# Altium project Flomio BLE-NFC.PrjPCB
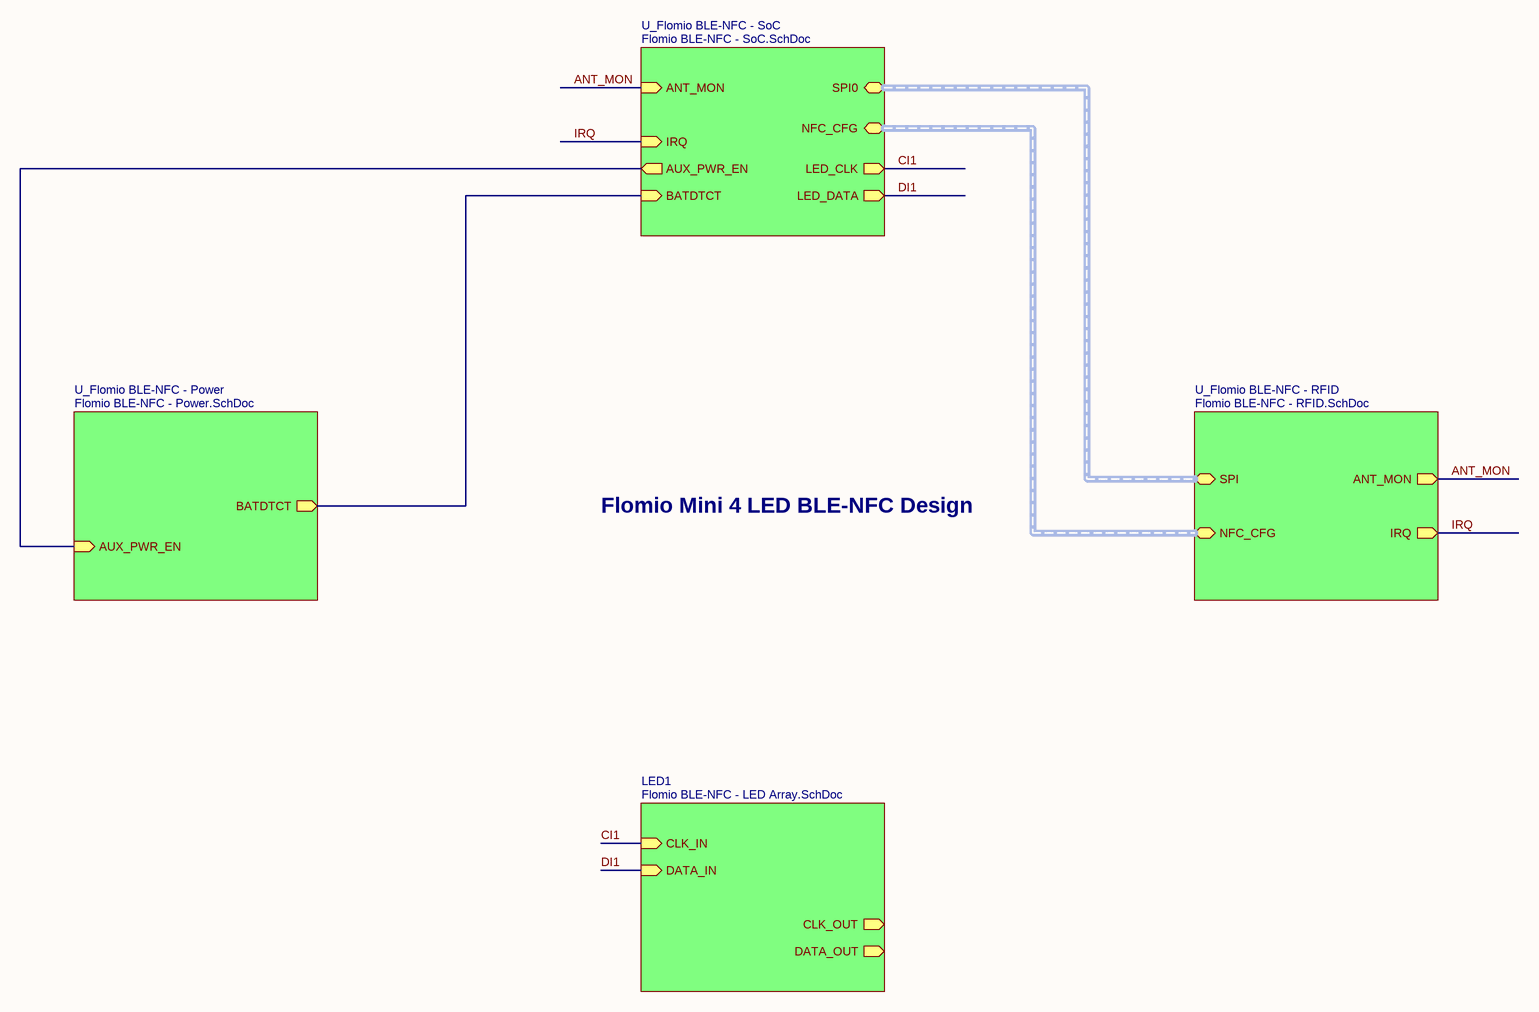
[diagram p0: Flomio BLE-NFC - Overview.SchDoc]
5 sheets, 143 parts. Net scope: hierarchical (ports join the sheet entries above them; power ports are global).
Board file: Flomio BLE-NFC.PcbDoc
Sheets:
  Flomio BLE-NFC - Overview.SchDoc
    LED1 = Flomio BLE-NFC - LED Array.SchDoc
    U_Flomio BLE-NFC - SoC = Flomio BLE-NFC - SoC.SchDoc
    U_Flomio BLE-NFC - RFID = Flomio BLE-NFC - RFID.SchDoc
    U_Flomio BLE-NFC - Power = Flomio BLE-NFC - Power.SchDoc

## Sheet Flomio BLE-NFC - Overview.SchDoc: Flomio BLE-NFC::Overview
size Tabloid; Author: Alex J. Tucker; CompanyName: Anidea Engineering, Inc.; DrawnBy: Alex J. Tucker; Engineer: Alex J. Tucker; Organization: Anidea Engineering, Inc.; Address1: 8020 Belvedere Rd.; Address2: Ste #1; Address3: West Palm Beach, FL; Address4: 33411    USA; DocumentNumber: 1; Revision: 3; SheetNumber: 1; SheetTotal: 5

### Sub-sheets
LED1 = Flomio BLE-NFC - LED Array.SchDoc: CLK_OUT (out), CLK_IN (in), DATA_IN (in), DATA_OUT (out)
U_Flomio BLE-NFC - Power = Flomio BLE-NFC - Power.SchDoc: BATDTCT (out), AUX_PWR_EN (in)
U_Flomio BLE-NFC - RFID = Flomio BLE-NFC - RFID.SchDoc: ANT_MON (out), SPI (harness SPI), NFC_CFG (harness NFC), IRQ (out)
U_Flomio BLE-NFC - SoC = Flomio BLE-NFC - SoC.SchDoc: ANT_MON (in), BATDTCT (in), SPI0 (harness SPI), NFC_CFG (harness NFC), LED_CLK (out), LED_DATA (out), IRQ (in), AUX_PWR_EN (out)

### Nets
ANT_MON: sheet U_Flomio BLE-NFC - SoC/ANT_MON, sheet U_Flomio BLE-NFC - RFID/ANT_MON
BATDTCT: sheet U_Flomio BLE-NFC - SoC/BATDTCT, sheet U_Flomio BLE-NFC - Power/BATDTCT
CI1: sheet LED1/CLK_IN, sheet U_Flomio BLE-NFC - SoC/LED_CLK
DI1: sheet LED1/DATA_IN, sheet U_Flomio BLE-NFC - SoC/LED_DATA  [project net DATA_IN]
IRQ: sheet U_Flomio BLE-NFC - SoC/IRQ, sheet U_Flomio BLE-NFC - RFID/IRQ
NetQ2_1: sheet U_Flomio BLE-NFC - SoC/AUX_PWR_EN, sheet U_Flomio BLE-NFC - Power/AUX_PWR_EN

### Buses and harness runs
harness sheet U_Flomio BLE-NFC - RFID/NFC_CFG = sheet U_Flomio BLE-NFC - SoC/NFC_CFG
harness sheet U_Flomio BLE-NFC - RFID/SPI = sheet U_Flomio BLE-NFC - SoC/SPI0

### Notes on the sheet
- Flomio Mini 4 LED BLE-NFC Design
- Confidential Document
  Unauthorized Use or Release
  Prohibited
- Checked By:
- Designed By:
- Title
- Size:
- Date:
- Tabloid
- Number:
- Time:
- Revision:
- Sheet
- of
- Approved By:
- File:

## Sheet Flomio BLE-NFC - LED Array.SchDoc: Flomio BLE-NFC::LED Array
size Tabloid; Author: Alex J. Tucker; CompanyName: Anidea Engineering, Inc.; DrawnBy: Alex J. Tucker; Engineer: Alex J. Tucker; Organization: Anidea Engineering, Inc.; Address1: 8020 Belvedere Rd.; Address2: Ste #1; Address3: West Palm Beach, FL; Address4: 33411    USA; DocumentNumber: 4; Revision: 3; SheetNumber: 4; SheetTotal: 5
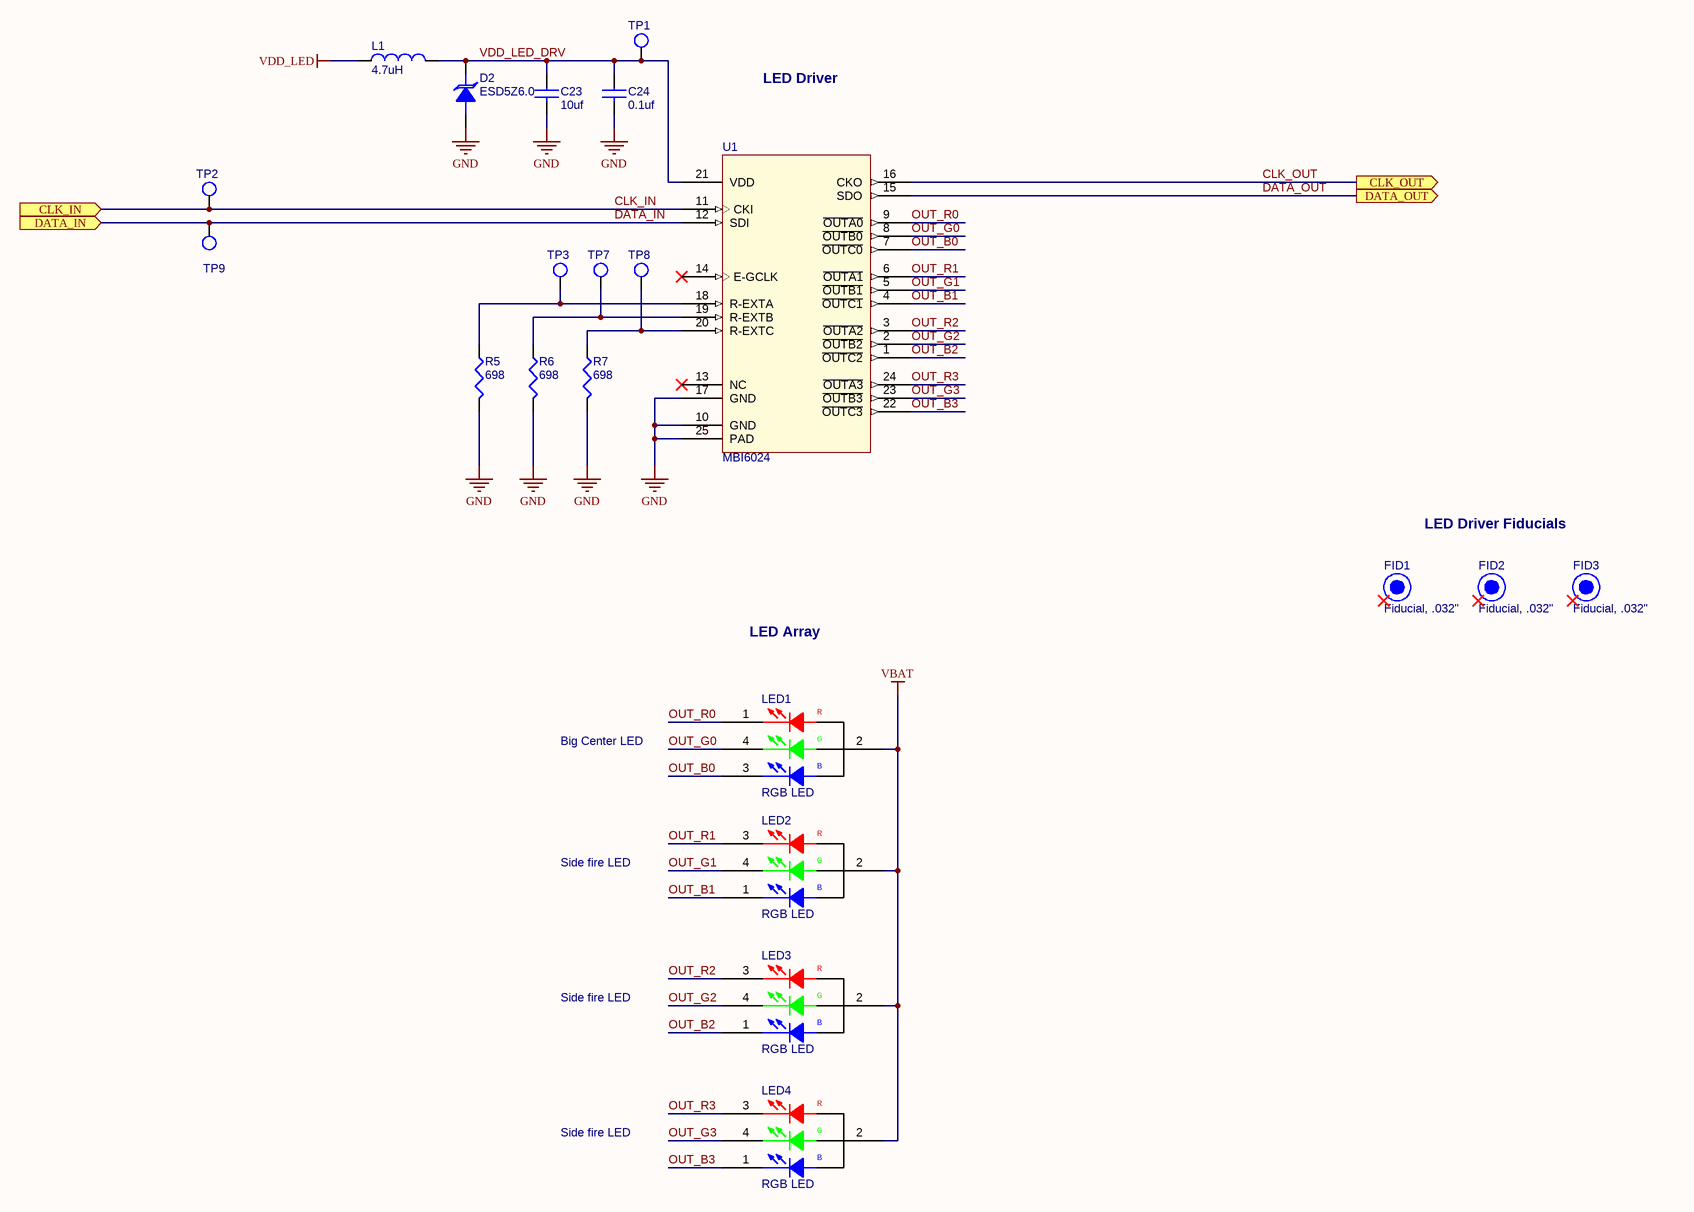
[diagram p1: Flomio BLE-NFC - LED Array.SchDoc]

### Parts
C23  10uf  [SM/C_0603]
C24  0.1uf  [SM/C_0402]
D2  ESD5Z6.0  [SOD-523]
FID1  Fiducial, .032"  [FID32]  (no BOM)
FID2  Fiducial, .032"  [FID32]  (no BOM)
FID3  Fiducial, .032"  [FID32]  (no BOM)
L1  4.7uH  [SM/I_0805]
LED1  RGB LED  [LED/PLCC4;LED/PLCC4/NOSLK]
LED2  RGB LED  [LED/AVAGO/HSMF-C115]
LED3  RGB LED  [LED/AVAGO/HSMF-C115]
LED4  RGB LED  [LED/AVAGO/HSMF-C115]
R5  698  [SM/R_0402]
R6  698  [SM/R_0402]
R7  698  [SM/R_0402]
TP1  TP  [VIA18]  (value not drawn)  (no BOM)
TP2  TP  [VIA18]  (value not drawn)  (no BOM)
TP3  TP  [VIA18]  (value not drawn)  (no BOM)
TP7  TP  [VIA18]  (value not drawn)  (no BOM)
TP8  TP  [VIA18]  (value not drawn)  (no BOM)
TP9  TP  [VIA18]  (value not drawn)  (no BOM)
U1  MBI6024  [QFN50P400X400X80-24N]

### Ports
CLK_IN (in), CLK_OUT (out), DATA_IN (in), DATA_OUT (out)

### Nets
GND: C23.2 C24.2 D2.1(ANODE) R5.2 R6.2 R7.2 U1.10(GND) U1.17(GND) U1.25(PAD)
VBAT: LED1.2(ANODDE) LED2.2(ANODDE) LED3.2(ANODDE) LED4.2(ANODDE)
VDD_LED: L1.1
CLK_IN: TP2.1(TP) U1.11(CKI) ; port CLK_IN  [project net CI1]
CLK_OUT: U1.16(CKO) ; port CLK_OUT
DATA_IN: TP9.1(TP) U1.12(SDI) ; port DATA_IN
DATA_OUT: U1.15(SDO) ; port DATA_OUT
OUT_B0: LED1.3(BLUEK) U1.7(~{OUTC0})
OUT_B1: LED2.1(BLUEK) U1.4(~{OUTC1})
OUT_B2: LED3.1(BLUEK) U1.1(~{OUTC2})
OUT_B3: LED4.1(BLUEK) U1.22(~{OUTC3})
OUT_G0: LED1.4(GREENK) U1.8(~{OUTB0})
OUT_G1: LED2.4(GREENK) U1.5(~{OUTB1})
OUT_G2: LED3.4(GREENK) U1.2(~{OUTB2})
OUT_G3: LED4.4(GREENK) U1.23(~{OUTB3})
OUT_R0: LED1.1(REDK) U1.9(~{OUTA0})
OUT_R1: LED2.3(REDK) U1.6(~{OUTA1})
OUT_R2: LED3.3(REDK) U1.3(~{OUTA2})
OUT_R3: LED4.3(REDK) U1.24(~{OUTA3})
VDD_LED_DRV: C23.1 C24.1 D2.2(CATHODE) L1.2 TP1.1(TP) U1.21(VDD)
NetR5_1: R5.1 TP3.1(TP) U1.18(R-EXTA)
NetR6_1: R6.1 TP7.1(TP) U1.19(R-EXTB)
NetR7_1: R7.1 TP8.1(TP) U1.20(R-EXTC)

Not connected (* = marked no-connect by the designer): FID1 1*; FID2 1*; FID3 1*; U1 13(NC)* 14(E-GCLK)*

### Notes on the sheet
- LED Driver
- LED Driver Fiducials
- LED Array
- Big Center LED
- Side fire LED
- Confidential Document
  Unauthorized Use or Release
  Prohibited
- Checked By:
- Designed By:
- Title
- Size:
- Date:
- Tabloid
- Number:
- Time:
- Revision:
- Sheet
- of
- Approved By:
- File:
- (in symbol CLVBA-FKA) R; G; B
- (in symbol HSMF-C115) R; G; B

### Library data of the parts
C23 = GRM188R60J106ME47: Cap, 0603, 10uf, 6.3V, 20%,; Mfg Part Number: GRM188R60J106ME47D; Mfg: Murata; Part Number: GRM188R60J106ME47; Tolerance: 20%; Voltage: 6.3V; ComponentLink1Description: Local; ComponentLink1URL: \\brak\public\pdf\Murata Cap PN.pdf; ComponentLink2Description: Web; Supplier Part Number 1: 490-3896-1-ND; Supplier 1: Digi-Key; RoHS: True
C24 = GRM155R71C104KA88: Cap, 0402, 0.1uf, 16V, 10%; Mfg Part Number: GRM155R71C104KA88D; Mfg: Murata; Part Number: GRM155R71C104KA88; Tolerance: 10%; Voltage: 16V; ComponentLink1Description: Local; ComponentLink1URL: \\brak\public\pdf\Murata Cap PN.pdf; ComponentLink2Description: Web; Supplier Part Number 1: 490-3261-1-ND; Supplier 1: Digi-Key; RoHS: True
D2 = ESD5Z6.0T1G: TVS, ESD, 6.0V, 30KV Pk, Unidirectional, SMT; Mfg: Onsemi; Rating: 240W; Part Number: ESD5Z6.0T1G; Voltage: 6.0V; Mfg Part Number: ESD5Z6.0T1G; ComponentLink1Description: Local; ComponentLink1URL: \\newbrak\public\pdf\Onsemi ESD5Z TVS-ESD.pdf; ComponentLink2Description: Web; Supplier Part Number 1: ESD5Z6.0T1GOSTR-ND; Supplier 1: Digi-Key; RoHS: True
FID1-FID3 = FID32: Fiducual, .032" Pad; Obsolete: False; Part Number: FID32; ComponentLink1Description: Local; ComponentLink1URL: \\brak\public\pdf\; ComponentLink2Description: Web; RoHS: False; Part Type: Misc\Fiducual
L1 = LQG21C4R7N00T1: Inductor, 4.7uH, 0805; Mfg: Murata; Rating: 30mA; Part Number: LQG21C4R7N00T1; Mfg Part Number: LQG21C4R7N00T1; ComponentLink1Description: Local; ComponentLink1URL: \\brak\public\pdf\\Murata SMT Inductors Chip Coils.pdf; ComponentLink2Description: Web; RoHS: True; ComponentLink2URL: http://search.murata.co.jp/Ceramy/image/img/PDF/ENG/L0075S0097LQM21D.pdf; Supplier Part Number 1: 490-1120-1-ND; Supplier 1: Digi-Key
LED1 = CLVBA-FKA: Diode, Led, RGB, PLCC4; Mfg Part Number: CLVBA-FKA-CAEDH8BBB7a36; Mfg: Cree; Part Number: CLVBA-FKA; ComponentLink1Description: Local; ComponentLink1URL: \\newbrak\public\pdf\Cree CLVBA-FKA RGB Led.pdf; ComponentLink2Description: Web; ComponentLink2URL: http://www.cree.com/products/pdf/ledlamps/CLVBA-FKA.pdf; Supplier Part Number 1: CLVBA-FKA-CAEDH8BBB7A363TR-ND; Supplier 1: Digi-key; RoHS: True
LED2-LED4 = HSMF-C115: Diode, Led, RGB, Side looking; Mfg: Avago; Part Number: HSMF-C115; Mfg Part Number: HSMF-C115; ComponentLink1Description: Local; ComponentLink1URL: \\brak\public\pdf\Avago AV02-0611EN LED.pdf; ComponentLink2Description: Web; ComponentLink2URL: http://www.avagotech.com/docs/AV02-0611EN; Supplier Part Number 1: HSMF-C115-ND; Supplier 1: Digi-key; RoHS: True
R5-R7 = CRCW0402698RFK: Resistor, 0402, 698 Ohm 1%; Mfg Part Number: CRCW0402698RFKED; Rating: 1/10W; Mfg: Vishay; Part Number: CRCW0402698RFK; Tolerance: 1%; ComponentLink1Description: Local; ComponentLink1URL: \\brak\public\pdf\Vishay CRCW Resistors.pdf; ComponentLink2Description: Web; Supplier Part Number 1: 541-698LCT-ND; Supplier 1: Digi-Key; RoHS: True
TP1-TP3 TP7-TP9 = TP18: Testpoint, 18mil Hole, No part, just via; Part Number: TP18; ComponentLink1Description: Local; ComponentLink2Description: Web; RoHS: False
U1 = MBI6024GFN: IC, Driver, 3x4 Led Driver, QFN24; Voltage: 5V; Mfg: Macroblock; Part Number: MBI6024GFN; Mfg Part Number: MBI6024GFN; ComponentLink1Description: Local; ComponentLink1URL: \\newbrak\public\pdf\Macroblock MBI6024 Preliminary Datasheet V2.00-EN.pdf; ComponentLink2Description: Web; ComponentLink2URL: http://www.mblock.com.tw/downfile.php?Code=ad13a2a07ca4b7642959dc0c4c740ab6; RoHS: True

## Sheet Flomio BLE-NFC - SoC.SchDoc: Flomio BLE-NFC::Soc
size Tabloid; Author: Alex J. Tucker; CompanyName: Anidea Engineering, Inc.; DrawnBy: Alex J. Tucker; Engineer: Alex J. Tucker; Organization: Anidea Engineering, Inc.; Address1: 8020 Belvedere Rd.; Address2: Ste #1; Address3: West Palm Beach, FL; Address4: 33411    USA; DocumentNumber: 2; Revision: 3; SheetNumber: 2; SheetTotal: 5
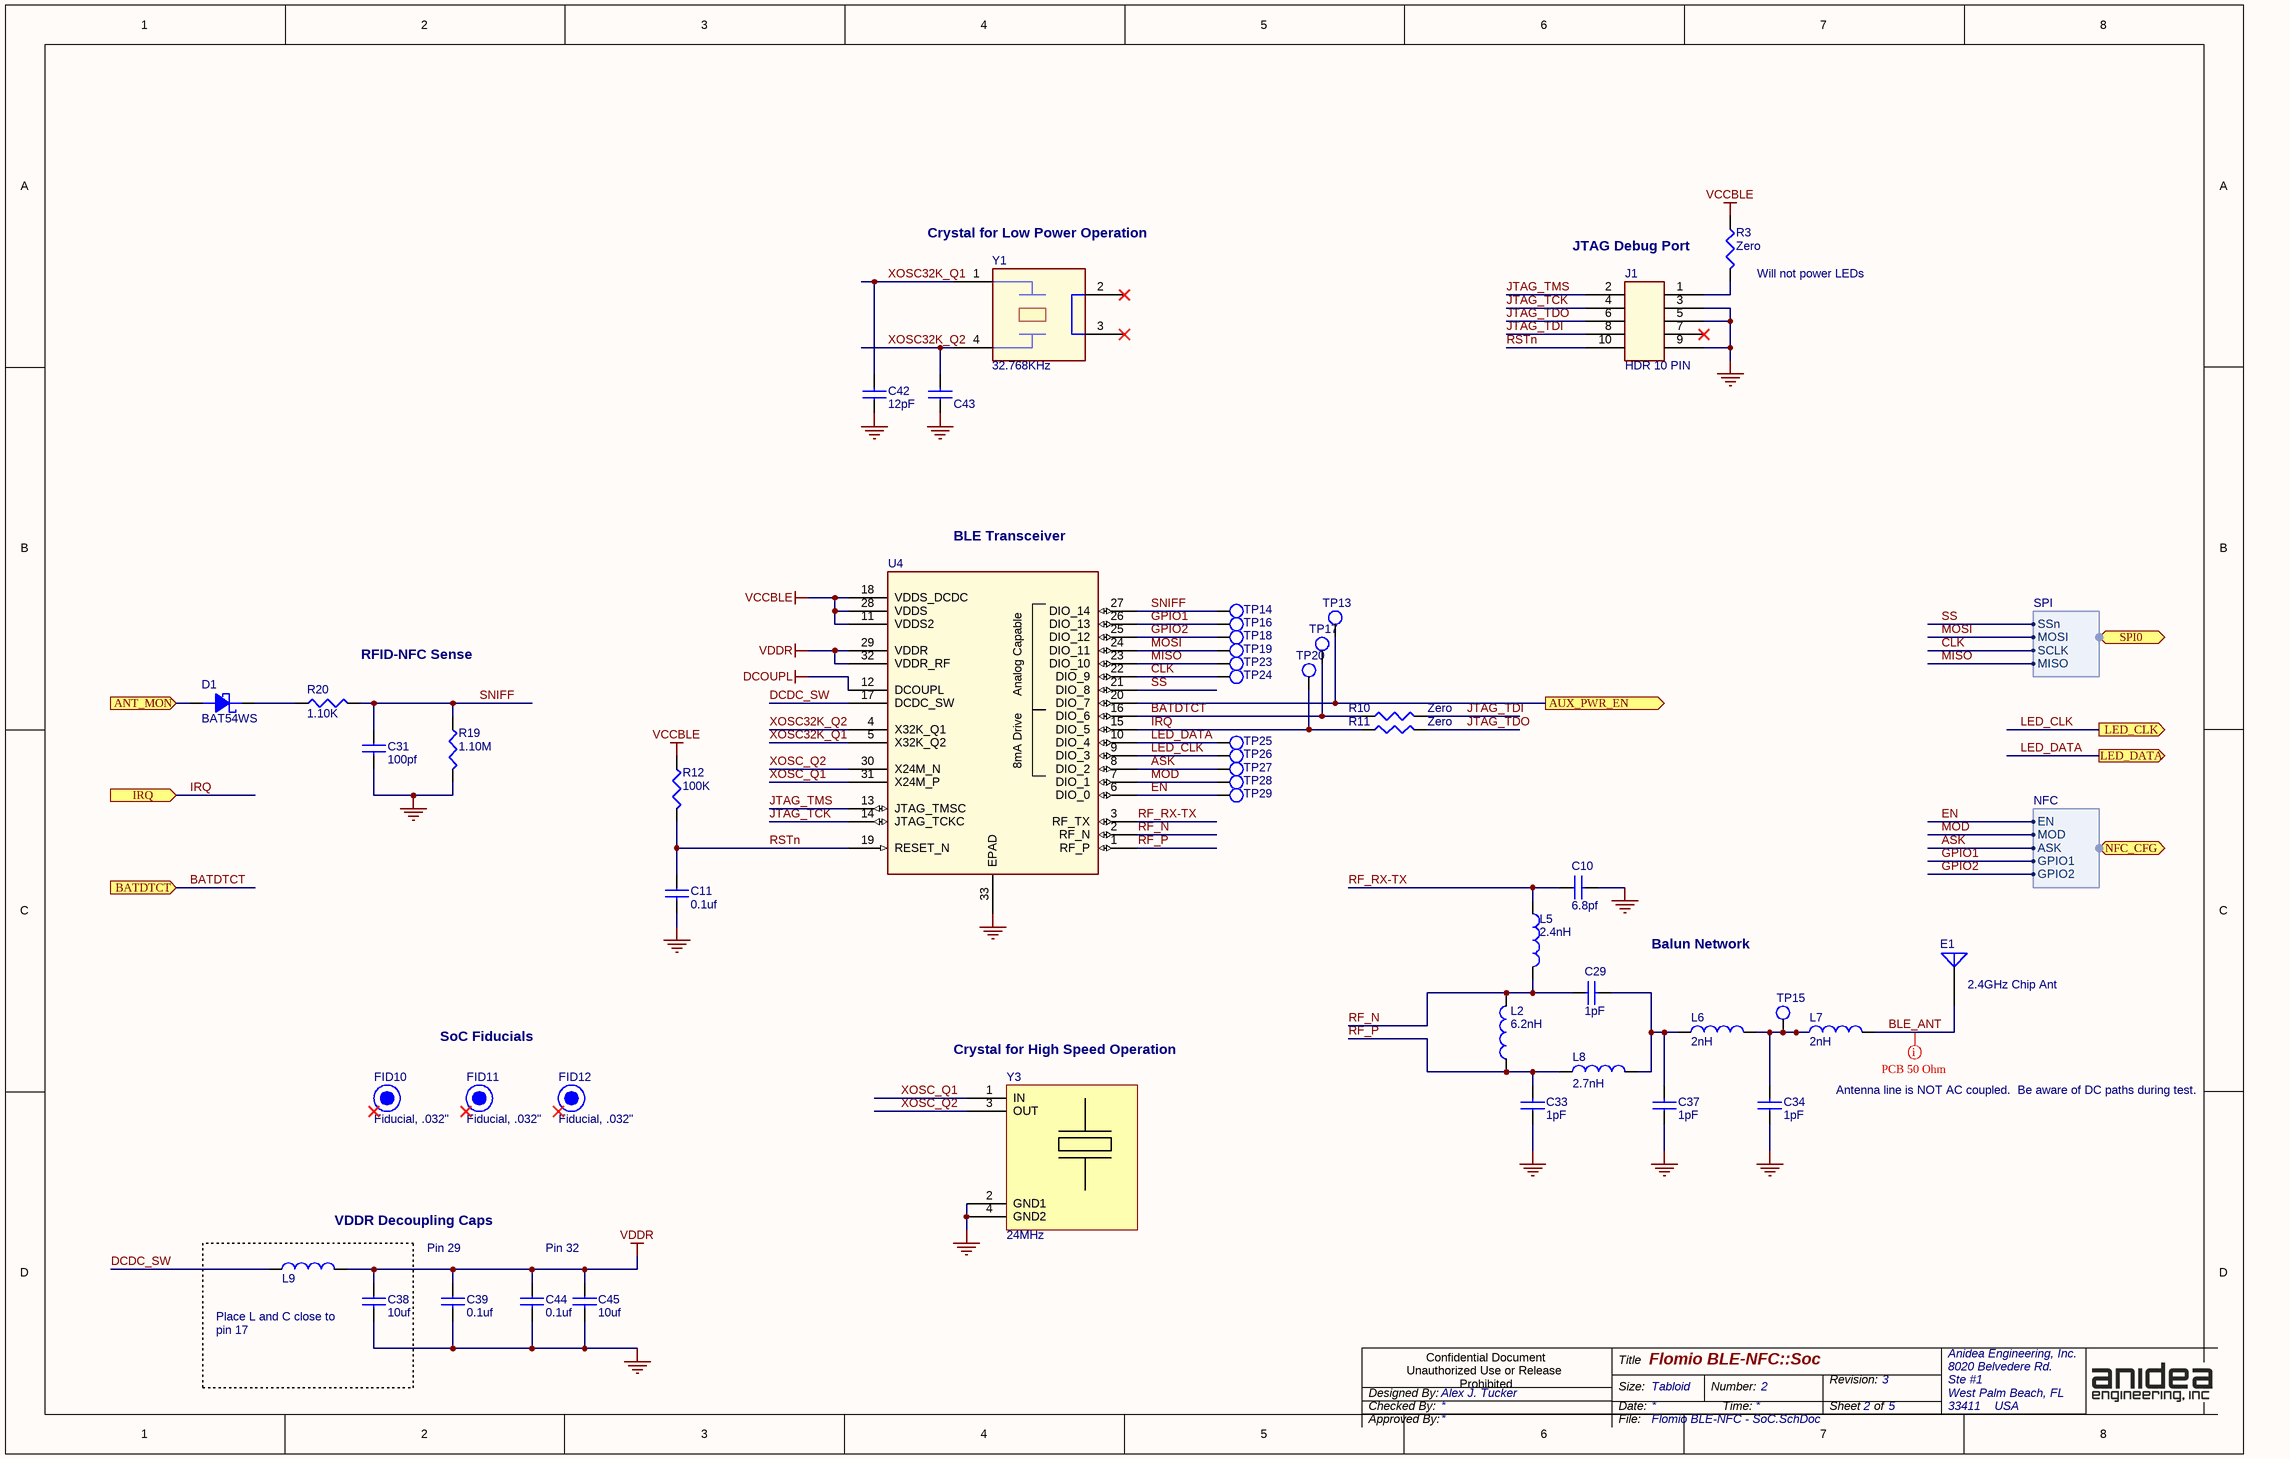
[diagram p2: Flomio BLE-NFC - SoC.SchDoc]

### Parts
(Parts that share a designator on the sheet are numbered #1, #2 ... from top to bottom, then left to right.)
C10  6.8pf  [SM/C_0603]
C11  0.1uf  [SM/C_0603]
C29#1  1pF  [SM/C_0402]
C31  100pf  [SM/C_0603]
C33#1  1pF  [SM/C_0402]
C34#1  1pF  [SM/C_0402]
C37  1pF  [SM/C_0402]
C38  10uf  [SM/C_0603]
C39  0.1uf  [SM/C_0603]
C42#1  12pF  [SM/C_0402]
C43  12pF  [SM/C_0402]  (value not drawn)
C44  0.1uf  [SM/C_0603]
C45  10uf  [SM/C_0603]
D1  BAT54WS  [SOD-323]
E1  2.4GHz Chip Ant  [SM_ANT_Johanson-2450AT43A100E]
FID10  Fiducial, .032"  [FID32]  (no BOM)
FID11  Fiducial, .032"  [FID32]  (no BOM)
FID12  Fiducial, .032"  [FID32]  (no BOM)
J1  HDR 10 PIN  [HDR/SM/2X5/1.27MM]
L2  6.2nH  [SM/I_0402]
L5#1  2.4nH  [SM/I_0402]
L6  2nH  [SM/I_0402]
L7  2nH  [SM/I_0402]
L8  2.7nH  [SM/I_0402]
L9  10uH  [SM/I_1210]  (value not drawn)
R3  Zero  [SM/R_0402]
R10  Zero  [SM/R_0402]
R11  Zero  [SM/R_0402]
R12  100K  [SM/R_0402]
R19  1.10M  [SM/R_0603]
R20  1.10K  [SM/R_0603]
TP13  TP  [VIA18]  (value not drawn)  (no BOM)
TP14  TP  [VIA18]  (value not drawn)  (no BOM)
TP15  TP  [VIA18]  (value not drawn)  (no BOM)
TP16  TP  [VIA18]  (value not drawn)  (no BOM)
TP17  TP  [VIA18]  (value not drawn)  (no BOM)
TP18  TP  [VIA18]  (value not drawn)  (no BOM)
TP19  TP  [VIA18]  (value not drawn)  (no BOM)
TP20  TP  [VIA18]  (value not drawn)  (no BOM)
TP23  TP  [VIA18]  (value not drawn)  (no BOM)
TP24  TP  [VIA18]  (value not drawn)  (no BOM)
TP25  TP  [VIA18]  (value not drawn)  (no BOM)
TP26  TP  [VIA18]  (value not drawn)  (no BOM)
TP27  TP  [VIA18]  (value not drawn)  (no BOM)
TP28  TP  [VIA18]  (value not drawn)  (no BOM)
TP29  TP  [VIA18]  (value not drawn)  (no BOM)
U4  CC2640_RHB_32  (value not drawn)
Y1  32.768KHz  [CRYSTAL/ABS25]
Y3#1  24MHz  [CRYSTAL/3.2x2.5mm]

### Blocks framed on the sheet
VDDR Decoupling Caps: C38 L9

### Ports
ANT_MON (in), AUX_PWR_EN (out), BATDTCT (in), IRQ (in), LED_CLK (out), LED_DATA (out), NFC_CFG (harness NFC), SPI0 (harness SPI)

### Harnesses
SPI: SSn, MOSI, SCLK, MISO
NFC: EN, MOD, ASK, GPIO1, GPIO2

### Nets
DCOUPL: U4.12(DCOUPL)
GND: C10.2 C11.2 C31.2 C33#1.1 C34#1.1 C37.1 C38.2 C39.2 C42#1.1 C43.1 C44.2 C45.2 J1.3 J1.5 J1.9 R19.2 U4.33(EPAD) Y3#1.2(GND1) Y3#1.4(GND2)
VCCBLE: R3.1 R12.1 U4.11(VDDS2) U4.18(VDDS_DCDC) U4.28(VDDS)
VDDR: C38.1 C39.1 C44.1 C45.1 L9.2 U4.29(VDDR) U4.32(VDDR_RF)
ANT_MON: D1.1(ANODE) ; port ANT_MON
ASK: TP27.1(TP) U4.8(DIO_2) ; port NFC_CFG.ASK
BATDTCT: R10.1 TP17.1(TP) U4.16(DIO_6) ; port BATDTCT
BLE_ANT: E1.1 L7.2
CLK: TP24.1(TP) U4.22(DIO_9) ; port SPI0.SCLK
DCDC_SW: L9.1 U4.17(DCDC_SW)
EN: TP29.1(TP) U4.6(DIO_0) ; port NFC_CFG.EN
GPIO1: TP16.1(TP) U4.26(DIO_13) ; port NFC_CFG.GPIO1
GPIO2: TP18.1(TP) U4.25(DIO_12) ; port NFC_CFG.GPIO2
IRQ: R11.1 TP20.1(TP) U4.15(DIO_5) ; port IRQ
JTAG_TCK: J1.4 U4.14(JTAG_TCKC)
JTAG_TDI: J1.8 R10.2
JTAG_TDO: J1.6 R11.2
JTAG_TMS: J1.2 U4.13(JTAG_TMSC)
LED_CLK: TP26.1(TP) U4.9(DIO_3) ; port LED_CLK  [project net CI1]
LED_DATA: TP25.1(TP) U4.10(DIO_4) ; port LED_DATA  [project net DATA_IN]
MISO: TP23.1(TP) U4.23(DIO_10) ; port SPI0.MISO
MOD: TP28.1(TP) U4.7(DIO_1) ; port NFC_CFG.MOD
MOSI: TP19.1(TP) U4.24(DIO_11) ; port SPI0.MOSI
RF_N: C29#1.1 L2.2 L5#1.2 U4.2(RF_N)
RF_P: C33#1.2 L2.1 L8.1 U4.1(RF_P)
RF_RX-TX: C10.1 L5#1.1 U4.3(RF_TX)
RSTn: C11.1 J1.10 R12.2 U4.19(RESET_N)
SNIFF: C31.1 R19.1 R20.2 TP14.1(TP) U4.27(DIO_14)
SS: U4.21(DIO_8) ; port SPI0.SSn  [project net SLAVE_SELECT]
XOSC32K_Q1: C42#1.2 U4.5(X32K_Q2) Y1.1
XOSC32K_Q2: C43.2 U4.4(X32K_Q1) Y1.4
XOSC_Q1: U4.31(X24M_P) Y3#1.1(IN)
XOSC_Q2: U4.30(X24M_N) Y3#1.3(OUT)
NetC29#1_2: C29#1.2 C37.2 L6.1 L8.2
NetC34#1_2: C34#1.2 L6.2 L7.1 TP15.1(TP)
NetD1_2: D1.2(CATHODE) R20.1
NetJ1_1: J1.1 R3.2
NetQ2_1: TP13.1(TP) U4.20(DIO_7) ; port AUX_PWR_EN

Not connected (* = marked no-connect by the designer): FID10 1*; FID11 1*; FID12 1*; J1 7*; Y1 2* 3*

### Layout directives
rule Width Constraint [Pref Width = 113mil    Min Width = 113mil    Max Width = 113mil]; rule Clearance Constraint [Clearance = 15mil]: BLE_ANT

### Notes on the sheet
- (near Y1) Crystal for Low Power Operation
- JTAG Debug Port
- (near R3) Will not power LEDs
- BLE Transceiver
- RFID-NFC Sense
- Balun Network
- SoC Fiducials
- (near Y3#1) Crystal for High Speed Operation
- Antenna line is NOT AC coupled.  Be aware of DC paths during test.
- (near C39) Pin 29
- Pin 32
- Place L and C close to pin 17
- Confidential Document
  Unauthorized Use or Release
  Prohibited
- Checked By:
- Designed By:
- Title
- Size:
- Date:
- Tabloid
- Number:
- Time:
- Revision:
- Sheet
- of
- Approved By:
- File:
- (in symbol CC2640_RHB_32) Analog Capable; 8mA Drive

### Library data of the parts
C10 = GRM1885C1H6R8CZ01: Cap, 0603, 6.8pf, 50V, ±0.25pF; Mfg Part Number: GRM1885C1H6R8CZ01D; Tolerance: 5%; Mfg: Murata; Part Number: GRM1885C1H6R8CZ01; Voltage: 50V; ComponentLink1Description: Local; ComponentLink1URL: \\newbrak\public\pdf\Murata Cap PN.pdf; ComponentLink2Description: Web; Supplier Part Number 1: 490-1395-1-ND; Supplier 1: Digi-Key; RoHS: True
C11 C39 C44 = GRM188R71C104KA01: Cap, 0603, 0.1uf, 16V, 10%, X7R; Mfg Part Number: GRM188R71C104KA01D; Mfg: Murata; Part Number: GRM188R71C104KA01; Rating: X7R; Tolerance: 10%; Voltage: 16V; ComponentLink1Description: Local; ComponentLink1URL: \\brak\public\pdf\Murata Cap PN.pdf; ComponentLink2Description: Web; Supplier Part Number 1: 490-1532-1-ND; Supplier 1: Digi-Key; RoHS: True
C29#1 C33#1 C34#1 C37 = GRM1555C1H1R0CZ01: Cap, 0402, 1pF, 50V, ±0.25pF, C0G, NP0; Mfg Part Number: GRM1555C1H1R0CZ01D; Mfg: Murata; Part Number: GRM1555C1H1R0CZ01; Rating: C0G, NP0; Tolerance: ±0.25pF; Voltage: 50V; ComponentLink1Description: Local; ComponentLink1URL: \\newbrak\public\pdf\Murata Cap PN.pdf; ComponentLink2Description: Web; ComponentLink2URL: http://www.murata.com/products/catalog/pdf/c02e.pdf; Supplier Part Number 1: 490-3199-1-ND; Supplier 1: Digi-Key; Supplier 2: Mouser; Supplier Part Number 2: 81-GRM1555C1H1R0CZ01; RoHS: True
C31 = 06035A101JAT2A: Cap, 0603, 100pf, 50V, 5%, C0G, NP0; Mfg: AVX; Part Number: 06035A101JAT2A; Tolerance: 5%; Voltage: 50V; Mfg Part Number: 06035A101JAT2A; ComponentLink1Description: Local; ComponentLink1URL: \\brak\public\pdf\AVX C0G.pdf; ComponentLink2Description: Web; Supplier Part Number 1: 478-1175-1-ND; Supplier 1: Digi-Key; RoHS: True; Rating: C0G, NP0; ComponentLink2URL: http://www.avx.com/docs/Catalogs/ccog.pdf
C38 C45 = GRM1886ME47: Cap, 0603, 10uf, 6.3V, 20%, X5R; Mfg Part Number: GRM188R60J106ME47D; Mfg: Murata; Part Number: GRM1886ME47; Tolerance: 20%; Voltage: 6.3V; ComponentLink1Description: Local; ComponentLink1URL: \\newbrak\public\pdf\Murata Cap PN.pdf; ComponentLink2Description: Web; Supplier Part Number 1: 490-3896-1-ND; Supplier 1: Digi-Key; RoHS: True
C42#1 C43 = GRM1555C1H120JZ01: Cap, 0402, 12pF, 50V, 5%, C0G, NP0; Mfg Part Number: GRM1555C1H120JZ01D; Mfg: Murata; Part Number: GRM1555C1H120JZ01; Tolerance: 5%; Voltage: 50V; ComponentLink1Description: Local; ComponentLink1URL: \\newbrak\public\pdf\Murata Cap PN.pdf; ComponentLink2Description: Web; Supplier Part Number 1: 490-1279-1-ND; Supplier 1: Digi-Key; RoHS: True; ComponentLink2URL: http://www.murata.com/products/catalog/pdf/c02e.pdf
D1 = BAT54WS-7-F: Diode, Schottky, 200MA, 30V, SOD323; Rating: 400W; Mfg: Diodes Inc.; Part Number: BAT54WS-7-F; Voltage: 30V; Mfg Part Number: BAT54WS-7-F; ComponentLink1Description: Local; ComponentLink1URL: \\brak\public\pdf\Diodes Inc BAT54WS ds30098.pdf; ComponentLink2Description: Web; ComponentLink2URL: http://www.diodes.com/datasheets/ds30098.pdf; Supplier Part Number 1: BAT54WS-FDICT-ND; Supplier 1: Digi-Key; RoHS: True
E1 = 2450AT43A100E: Antenna, Chip, 2.4GHz, 0.5 dBi Gain, BLE; Mfg: Johanson; Part Number: 2450AT43A100E; Mfg Part Number: 2450AT43A100E; ComponentLink1Description: Local; ComponentLink1URL: \\newbrak\public\pdf\Johanson JTI_Antenna-2450AT43A100_1-04.pdf; ComponentLink2Description: Web; ComponentLink2URL: http://www.johansontechnology.com/images/stories/ip/rf-antennas/JTI_Antenna-2450AT43A100_1-04.pdf; Supplier Part Number 1: 712-1009-1-ND; Supplier 1: Digi-Key; RoHS: True
FID10-FID12 = FID32: Fiducual, .032" Pad; Obsolete: False; Part Number: FID32; ComponentLink1Description: Local; ComponentLink1URL: \\brak\public\pdf\; ComponentLink2Description: Web; RoHS: False; Part Type: Misc\Fiducual
J1 = FTS-105-01-F-DV: Header, Dual Row, 10 pin, 1.27MM, Male, SMT; Mfg: Samtec; Part Number: FTS-105-01-F-DV; Mfg Part Number: FTS-105-01-F-DV; ComponentLink1Description: Local; ComponentLink1URL: \\brak\public\pdf\Samtec FTS Headers.PDF; ComponentLink2Description: Web; ComponentLink2URL: http://www.samtec.com/documents/webfiles/pdf/FTS.PDF; Supplier 1: Samtec; RoHS: True
L2 = LQG15HS6N2S02: Inductor, 0402, 6.2nH, 300mA, ±0.3nH; Mfg Part Number: LQG15HS6N2S02D; Mfg: Murata; Part Number: LQG15HS6N2S02; Rating: 300mA; Tolerance: ±0.3nH; ComponentLink1Description: Local; ComponentLink1URL: \\newbrak\public\pdf\Murata LQG15HS.pdf; ComponentLink2Description: Web; ComponentLink2URL: http://search.murata.co.jp/Ceramy/image/img/PDF/ENG/L0075S0083LQG15HS.pdf; Supplier Part Number 1: 490-2620-1-ND; Supplier 1: Digi-Key; Supplier 2: Mouser; Supplier Part Number 2: 81-LQG15HS6N2S02D; RoHS: True
L5#1 = LQG15HS2N4S02: Inductor, 0402, 2.4nH, 300mA, ±0.3nH; Mfg Part Number: LQG15HS2N4S02D; Mfg: Murata; Part Number: LQG15HS2N4S02; Rating: 300mA; Tolerance: ±0.3nH; ComponentLink1Description: Local; ComponentLink1URL: \\newbrak\public\pdf\Murata LQG15HS.pdf; ComponentLink2Description: Web; ComponentLink2URL: http://search.murata.co.jp/Ceramy/image/img/PDF/ENG/L0075S0083LQG15HS.pdf; Supplier Part Number 1: 490-8389-1-ND; Supplier 1: Digi-Key; RoHS: True; Supplier 2: Mouser; Supplier Part Number 2: 81-LQG15HS2N4S02D
L6 L7 = LQG15HS2N0S02: Inductor, 0402, 2nH, 300mA, ±0.3nH; Mfg Part Number: LQG15HS2N0S02D; Mfg: Murata; Part Number: LQG15HS2N0S02; Rating: 300mA; Tolerance: ±0.3nH; ComponentLink1Description: Local; ComponentLink1URL: \\newbrak\public\pdf\Murata LQG15HS.pdf; ComponentLink2Description: Web; ComponentLink2URL: http://search.murata.co.jp/Ceramy/image/img/PDF/ENG/L0075S0083LQG15HS.pdf; Supplier Part Number 1: 490-6569-1-ND; Supplier 1: Digi-Key; RoHS: True; Supplier 2: Mouser; Supplier Part Number 2: 81-LQG15HS2N0S02D
L8 = LQG15HS2N7S02: Inductor, 0402, 2.7nH, 300mA, ±0.3nH; Mfg Part Number: LQG15HS2N7S02D; Mfg: Murata; Part Number: LQG15HS2N7S02; Rating: 300mA; Tolerance: ±0.3nH; ComponentLink1Description: Local; ComponentLink1URL: \\newbrak\public\pdf\Murata LQG15HS.pdf; ComponentLink2Description: Web; ComponentLink2URL: http://search.murata.co.jp/Ceramy/image/img/PDF/ENG/L0075S0083LQG15HS.pdf; Supplier Part Number 1: 490-2615-1-ND; Supplier 1: Digi-Key; RoHS: True; Supplier 2: Mouser; Supplier Part Number 2: 81-LQG15HS2N7S02D
L9 = LQH32CN100K23L: Inductor, 1210, 10uH, 300ma; Mfg: Murata; Part Number: LQH32CN100K23L; Rating: 300MA; Mfg Part Number: LQH32CN100K23L; ComponentLink1Description: Local; ComponentLink1URL: \\newbrak\public\pdf\Murata LQH31C, LQH32C, LQH43C Inductors.pdf; ComponentLink2Description: Web; Supplier Part Number 1: 490-2496-1-ND; Supplier 1: Digi-Key; RoHS: True
R3 R10 R11 = CRCW04020000Z0ED: Resistor, 0402, Zero Ohm; Rating: 1/16W; Mfg: Vishay; Part Number: CRCW04020000Z0ED; Tolerance: ZERO; Mfg Part Number: CRCW04020000Z0ED; ComponentLink1Description: Local; ComponentLink1URL: \\newbrak\public\pdf\Vishay CRCW Resistors.pdf; ComponentLink2Description: Web; ComponentLink2URL: http://www.vishay.com/doc?20035; Supplier Part Number 1: 541-0.0JCT-ND; Supplier 1: Digi-Key; Supplier 2: Yageo; Supplier Part Number 2: RC0402JR-070RL; RoHS: True
R12 = CRCW0402100KF: Resistor, 0402, 100K Ohm 1%; Mfg Part Number: CRCW0402100KFKED; Rating: 1/16W; Mfg: Vishay; Part Number: CRCW0402100KF; Tolerance: 1%; ComponentLink1Description: Local; ComponentLink1URL: \\newbrak\public\pdf\Vishay CRCW Resistors.pdf; ComponentLink2Description: Web; ComponentLink2URL: http://www.vishay.com/doc?20035; Supplier Part Number 1: 541-100KLCT-ND; Supplier 1: Digi-Key; RoHS: True
R19 = ERJ-3EKF1104V: Resistor, 0603, 1.10M Ohm 1%; Rating: 1/10W; Mfg: Panasonic; Part Number: ERJ-3EKF1104V; Tolerance: 1%; Mfg Part Number: ERJ-3EKF1104V; ComponentLink1Description: Local; ComponentLink1URL: \\brak\public\pdf\Panasonic AOA0000CE1 Chip Res.pdf; ComponentLink2Description: Web; Supplier Part Number 1: P1.10MHCT-ND; Supplier 1: Digi-Key; RoHS: True; ComponentLink2URL: http://industrial.panasonic.com/www-data/pdf/AOA0000/AOA0000CE1.pdf
R20 = ERJ-3EKF1101V: Resistor, 0603, 1.10K Ohm 1%; Rating: 1/10W; Mfg: Panasonic; Part Number: ERJ-3EKF1101V; Tolerance: 1%; Mfg Part Number: ERJ-3EKF1101V; ComponentLink1Description: Local; ComponentLink1URL: \\brak\public\pdf\Panasonic AOA0000CE1 Chip Res.pdf; ComponentLink2Description: Web; Supplier Part Number 1: P1.10KHCT-ND; Supplier 1: Digi-Key; RoHS: True; ComponentLink2URL: http://industrial.panasonic.com/www-data/pdf/AOA0000/AOA0000CE1.pdf
TP13-TP20 TP23-TP29 = TP18: as TP1 on sheet Flomio BLE-NFC - LED Array; ComponentLink1Description: Local; ComponentLink2Description: Web; RoHS: False
Y1 = ABS25-32.768KHZ-T: Crystal, SMT, 32.768KHz, 12.5pf; Tolerance: ±20ppm; Mfg: Abracon; Part Number: ABS25-32.768KHZ-T; Rating: 12.5pf; Mfg Part Number: ABS25-32.768KHZ-T; ComponentLink1Description: Local; ComponentLink1URL: \\brak\public\pdf\Abracon ABS25 32,768kHz SMD.pdf; ComponentLink2Description: Web; ComponentLink2URL: http://www.abracon.com/Resonators/abs25.pdf; Supplier Part Number 1: 535-9166-1-ND; Supplier 1: Digi-Key; RoHS: True
Y3#1 = NX3225SA-24.000000MHZ: Crystal, SMT, 24MHz, 8pF, 15ppm; Tolerance: +/- 15ppm; Mfg: NDK; Part Number: NX3225SA-24.000000MHZ; Mfg Part Number: NX3225SA-24.000000MHZ; ComponentLink1Description: Local; ComponentLink1URL: \\newbrak\public\pdf\NDK NX3225SA.pdf; ComponentLink2Description: Web; ComponentLink2URL: http://media.digikey.com/pdf/Data%20Sheets/NDK%20PDFs/NX3225SA.pdf; Supplier Part Number 1: 644-1052-2-ND; Supplier 1: Digi-Key; RoHS: True

## Sheet Flomio BLE-NFC - RFID.SchDoc: Flomio BLE-NFC::RFID
size Tabloid; Author: Alex J. Tucker; CompanyName: Anidea Engineering, Inc.; DrawnBy: Alex J. Tucker; Engineer: Alex J. Tucker; Organization: Anidea Engineering, Inc.; Address1: 8020 Belvedere Rd.; Address2: Ste #1; Address3: West Palm Beach, FL; Address4: 33411    USA; DocumentNumber: 3; Revision: 3; SheetNumber: 3; SheetTotal: 5
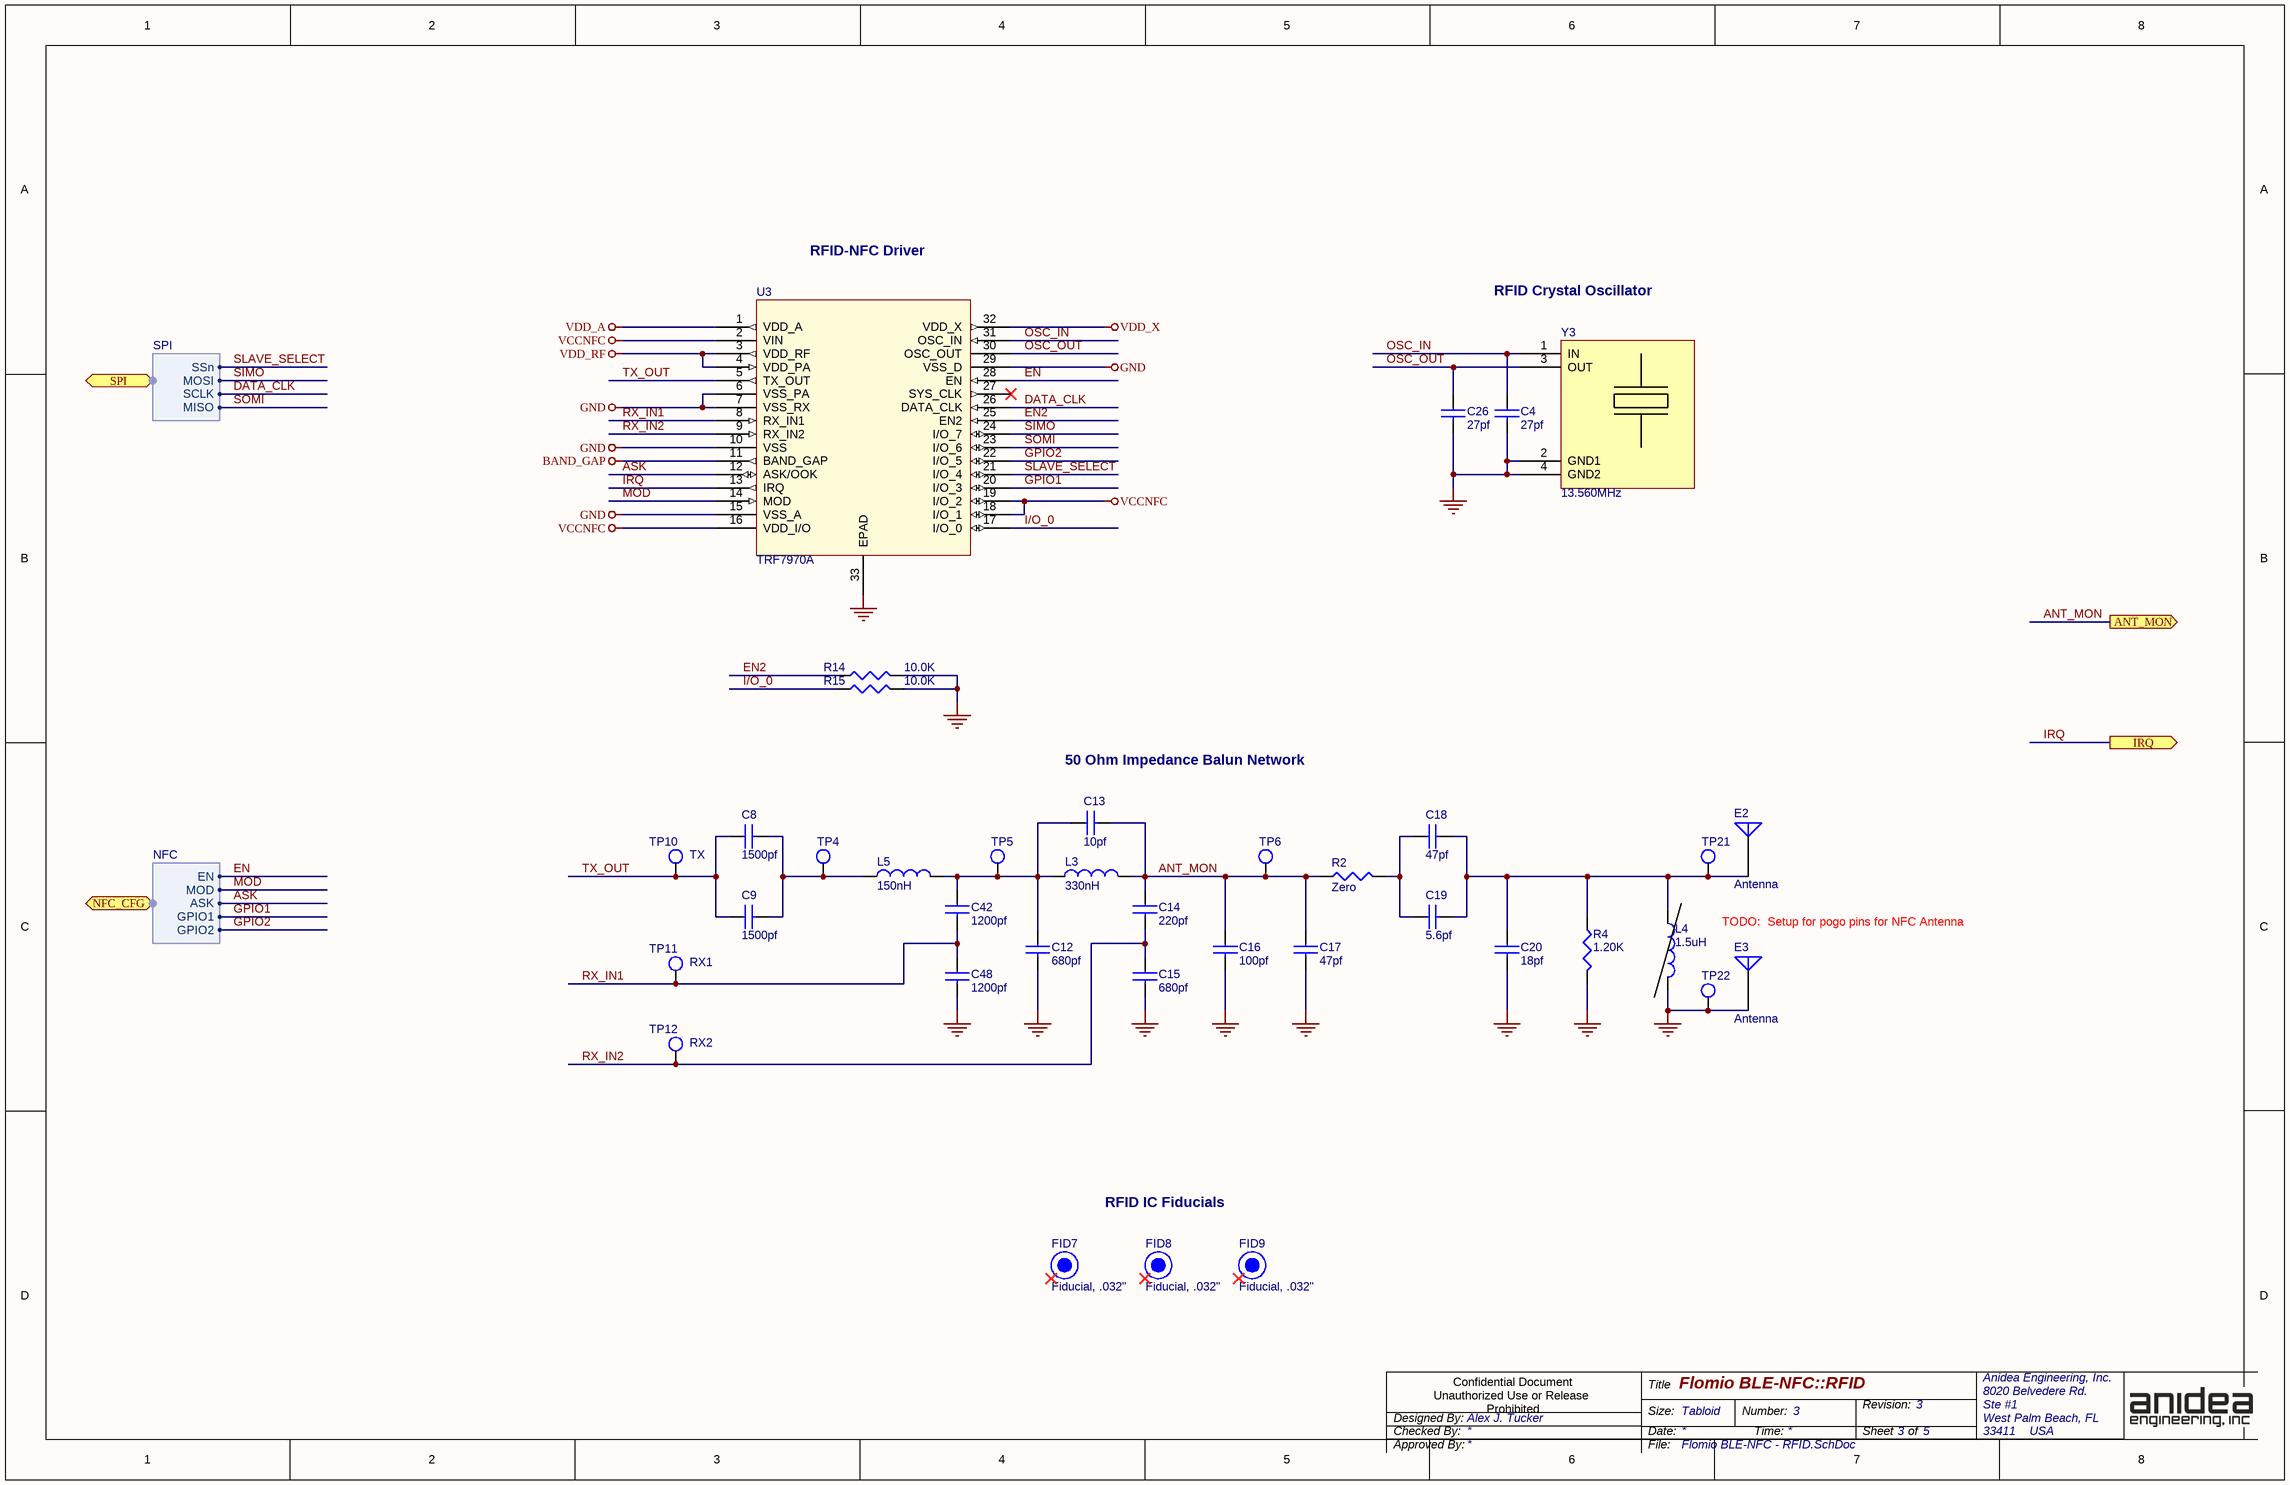
[diagram p3: Flomio BLE-NFC - RFID.SchDoc]

### Parts
(Parts that share a designator on the sheet are numbered #1, #2 ... from top to bottom, then left to right.)
C4  27pf  [SM/C_0603]
C8  1500pf  [SM/C_0603]
C9  1500pf  [SM/C_0603]
C12  680pf  [SM/C_0603]
C13  10pf  [SM/C_0603]
C14  220pf  [SM/C_0603]
C15  680pf  [SM/C_0603]
C16  100pf  [SM/C_0603]
C17  47pf  [SM/C_0603]
C18  47pf  [SM/C_0603]
C19  5.6pf  [SM/C_0603]
C20  18pf  [SM/C_0603]
C26  27pf  [SM/C_0603]
C42#2  1200pf  [SM/C_0603]
C48  1200pf  [SM/C_0603]
E2  Antenna  [CST/FLOMIO/ANT]
E3  Antenna  [CST/FLOMIO/ANT]
FID7  Fiducial, .032"  [FID32]  (no BOM)
FID8  Fiducial, .032"  [FID32]  (no BOM)
FID9  Fiducial, .032"  [FID32]  (no BOM)
L3  330nH  [SM/I_1008]
L4  1.5uH  [SM/I_0603]
L5#2  150nH  [SM/I_1008]
R2  Zero  [SM/R_0603]
R4  1.20K  [SM/R_0603]
R14  10.0K  [SM/R_0603]
R15  10.0K  [SM/R_0603]
TP4  TP  [VIA18]  (value not drawn)  (no BOM)
TP5  TP  [VIA18]  (value not drawn)  (no BOM)
TP6  TP  [VIA18]  (value not drawn)  (no BOM)
TP10  TX  [VIA18]  (no BOM)
TP11  RX1  [VIA18]  (no BOM)
TP12  RX2  [VIA18]  (no BOM)
TP21  TP  [VIA28]  (value not drawn)  (no BOM)
TP22  TP  [VIA28]  (value not drawn)  (no BOM)
U3  TRF7970A  [QFN50P500X500X100-32N]
Y3#2  13.560MHz  [CRYSTAL/ABM8G]

### Ports
ANT_MON (out), IRQ (out), NFC_CFG (harness NFC), SPI (harness SPI)

### Harnesses
SPI: SSn, MOSI, SCLK, MISO
NFC: EN, MOD, ASK, GPIO1, GPIO2

### Nets
BAND_GAP: U3.11(BAND_GAP)
GND: C4.2 C12.2 C15.2 C16.2 C17.2 C20.2 C26.2 C48.2 E3.1 L4.2 R4.2 R14.2 R15.2 TP22.1(TP) U3.6(VSS_PA) U3.7(VSS_RX) U3.10(VSS) U3.15(VSS_A) U3.29(VSS_D) U3.33(EPAD) Y3#2.2(GND1) Y3#2.4(GND2)
VCCNFC: U3.2(VIN) U3.16(VDD_I/O) U3.18(I/O_1) U3.19(I/O_2)
VDD_A: U3.1(VDD_A)
VDD_RF: U3.3(VDD_RF) U3.4(VDD_PA)
VDD_X: U3.32(VDD_X)
ANT_MON: C13.2 C14.1 C16.1 C17.1 L3.2 R2.1 TP6.1(TP) ; port ANT_MON
ASK: U3.12(ASK/OOK) ; port NFC_CFG.ASK
DATA_CLK: U3.26(DATA_CLK) ; port SPI.SCLK  [project net CLK]
EN: U3.28(EN) ; port NFC_CFG.EN
EN2: R14.1 U3.25(EN2)
GPIO1: U3.20(I/O_3) ; port NFC_CFG.GPIO1
GPIO2: U3.22(I/O_5) ; port NFC_CFG.GPIO2
I/O_0: R15.1 U3.17(I/O_0)
IRQ: U3.13(IRQ) ; port IRQ
MOD: U3.14(MOD) ; port NFC_CFG.MOD
OSC_IN: C4.1 U3.31(OSC_IN) Y3#2.1(IN)
OSC_OUT: C26.1 U3.30(OSC_OUT) Y3#2.3(OUT)
RX_IN1: C42#2.2 C48.1 TP11.1(TP) U3.8(RX_IN1)
RX_IN2: C14.2 C15.1 TP12.1(TP) U3.9(RX_IN2)
SIMO: U3.24(I/O_7) ; port SPI.MOSI  [project net MOSI]
SLAVE_SELECT: U3.21(I/O_4) ; port SPI.SSn
SOMI: U3.23(I/O_6) ; port SPI.MISO  [project net MISO]
TX_OUT: C8.1 C9.1 TP10.1(TP) U3.5(TX_OUT)
NetC8_2: C8.2 C9.2 L5#2.1 TP4.1(TP)
NetC12_1: C12.1 C13.1 C42#2.1 L3.1 L5#2.2 TP5.1(TP)
NetC18_1: C18.1 C19.1 R2.2
NetC18_2: C18.2 C19.2 C20.1 E2.1 L4.1 R4.1 TP21.1(TP)

Not connected (* = marked no-connect by the designer): FID7 1*; FID8 1*; FID9 1*; U3 27(SYS_CLK)*

### Notes on the sheet
- RFID-NFC Driver
- RFID Crystal Oscillator
- 50 Ohm Impedance Balun Network
- TODO:  Setup for pogo pins for NFC Antenna
- RFID IC Fiducials
- Confidential Document
  Unauthorized Use or Release
  Prohibited
- Checked By:
- Designed By:
- Title
- Size:
- Date:
- Tabloid
- Number:
- Time:
- Revision:
- Sheet
- of
- Approved By:
- File:

### Library data of the parts
C4 C26 = C0603C270J5GACTU: Cap, 0603, 27pf , 50V, 5%, C0G, NP0; Mfg: Kemet; Part Number: C0603C270J5GACTU; Tolerance: 5%; Voltage: 50V; Mfg Part Number: C0603C270J5GACTU; ComponentLink1Description: Local; ComponentLink1URL: \\brak\public\pdf\Kemet Ceramic C0G.pdf; ComponentLink2Description: Web; Supplier Part Number 1: 399-1054-1-ND; Supplier 1: Digi-Key; RoHS: True; Rating: C0G, NP0; ComponentLink2URL: http://www.kemet.com/kemet/web/homepage/kechome.nsf/vapubfiles/KEM_C1003_C0G_SMD.pdf/$file/KEM_C1003_C0G_SMD.pdf
C8 C9 = CC0603KRX7R9BB152: Cap, 0603, 1500pf, 50V, 10%, X7R; Mfg: Yageo; Part Number: CC0603KRX7R9BB152; Tolerance: 10%; Voltage: 50V; Mfg Part Number: CC0603KRX7R9BB152; ComponentLink1Description: Local; ComponentLink1URL: \\brak\public\pdf\Yageo SMT Cap class 2 x7r.pdf; ComponentLink2Description: Web; RoHS: True; Rating: X7R; ComponentLink2URL: http://www.yageo.com/documents/recent/UPY-GPHC_X7R_6.3V-to-50V_8.pdf; Supplier Part Number 1: 311-1184-1-ND; Supplier 1: Digi-Key
C12 C15 = C0603C681K5RACTU: Cap, 0603, 680pf , 50V, 10%, X7R; Mfg: Kemet; Part Number: C0603C681K5RACTU; Tolerance: 10%; Voltage: 50V; Mfg Part Number: C0603C681K5RACTU; ComponentLink1Description: Local; ComponentLink1URL: \\brak\public\pdf\Kemet Ceramic X7R.pdf; ComponentLink2Description: Web; ComponentLink2URL: http://www.kemet.com/kemet/web/homepage/kechome.nsf/vapubfiles/KEM_C1002_X7R_SMD.pdf/$file/KEM_C1002_X7R_SMD.pdf; Supplier Part Number 1: 399-1077-1-ND; Supplier 1: Digi-Key; RoHS: True; Rating: X7R
C13 = 06035A100JAT2A: Cap, 0603, 10pf, 50V, 5%, C0G, NP0; Mfg: AVX; Part Number: 06035A100JAT2A; Tolerance: 5%; Voltage: 50V; Mfg Part Number: 06035A100JAT2A; ComponentLink1Description: Local; ComponentLink1URL: \\brak\public\pdf\AVX C0G.pdf; ComponentLink2Description: Web; Supplier Part Number 1: 478-1163-1-ND; Supplier 1: Digi-Key; RoHS: True; Rating: C0G, NP0; ComponentLink2URL: http://www.avx.com/docs/Catalogs/ccog.pdf
C14 = CC0603KRX7R9BB221: Cap, 0603, 220pf, 50V, 10%, X7R; Mfg: Yageo; Part Number: CC0603KRX7R9BB221; Tolerance: 10%; Voltage: 50V; Mfg Part Number: CC0603KRX7R9BB221; ComponentLink1Description: Local; ComponentLink1URL: \\brak\public\pdf\Yageo SMT Cap class 2 x7r.pdf; ComponentLink2Description: Web; Supplier Part Number 1: 311-1077-1-ND; Supplier 1: Digi-Key; RoHS: True; Rating: X7R; ComponentLink2URL: http://www.yageo.com/documents/recent/UPY-GPHC_X7R_6.3V-to-50V_8.pdf
C16 = 06035A101JAT2A: as C31 on sheet Flomio BLE-NFC - SoC; Part Number: 06035A101JAT2A; Tolerance: 5%; Voltage: 50V; Mfg Part Number: 06035A101JAT2A; ComponentLink1Description: Local; ComponentLink1URL: \\brak\public\pdf\AVX C0G.pdf; ComponentLink2Description: Web; Supplier Part Number 1: 478-1175-1-ND; Supplier 1: Digi-Key; RoHS: True; Rating: C0G, NP0; ComponentLink2URL: http://www.avx.com/docs/Catalogs/ccog.pdf
C17 = 06031A470JAT2A: Cap, 0603, 47pf, 100V, 5%, C0G, NP0; Mfg: AVX; Part Number: 06031A470JAT2A; Tolerance: 5%; Voltage: 100V; Mfg Part Number: 06031A470JAT2A; ComponentLink1Description: Local; ComponentLink1URL: \\brak\public\pdf\AVX C0G.pdf; ComponentLink2Description: Web; Supplier Part Number 1: 478-1144-1-ND; Supplier 1: Digi-Key; RoHS: True; Rating: C0G, NP0; ComponentLink2URL: http://www.avx.com/docs/Catalogs/ccog.pdf
C18 = GRM1885CD1H470JA01D: Cap, 0603, 47pf , 50V, 5%, C0G, NP0; Mfg Part Number: GRM1885C1H470JA01D; Mfg: Murata; Part Number: GRM1885CD1H470JA01D; Rating: C0G, NP0; Tolerance: 5%; Voltage: 50V; ComponentLink1Description: Local; ComponentLink1URL: \\newbrak\public\pdf\Murata Cap PN.pdf; ComponentLink2Description: Web; Supplier Part Number 1: 490-1419-1-ND; Supplier 1: Digi-Key; RoHS: True
C19 = GRM1885C1H5R6DZ01D: Cap, 0603, 5.6pf, 50V, ±0.5pF; Mfg: Murata; Part Number: GRM1885C1H5R6DZ01D; Tolerance: ±0.5pF; Voltage: 50V; Mfg Part Number: GRM1885C1H5R6DZ01D; ComponentLink1Description: Local; ComponentLink1URL: \\newbrak\public\pdf\Murata Cap PN.pdf; ComponentLink2Description: Web; Supplier Part Number 1: 490-1392-1-ND; Supplier 1: Digi-Key; RoHS: True
C20 = GCM1885C1H180JA16: Cap, 0603, 18pf, 50V, 5%, C0G, NP0; Mfg Part Number: GCM1885C1H180JA16D; Mfg: Murata; Part Number: GCM1885C1H180JA16; Tolerance: 5%; Voltage: 50V; ComponentLink1Description: Local; ComponentLink1URL: \\newbrak\public\pdf\Murata Cap PN.pdf; ComponentLink2Description: Web; Supplier Part Number 1: 490-6046-1-ND; Supplier 1: Digi-Key; RoHS: True; Rating: C0G, NP0; ComponentLink2URL: http://search.murata.co.jp/Ceramy/image/img/w_hinm/L0005E.pdf
C42#2 C48 = GRM1885C1H122JA01: Cap, 0603, 1200pf, 50V, 5%, C0G, NP0; Mfg Part Number: GRM1885C1H122JA01D; Mfg: Murata; Part Number: GRM1885C1H122JA01; Rating: C0G, NP0; Tolerance: 5%; Voltage: 50V; ComponentLink1Description: Local; ComponentLink1URL: \\newbrak\public\pdf\Murata Cap PN.pdf; ComponentLink2Description: Web; Supplier Part Number 1: 490-1453-1-ND; Supplier 1: Digi-Key; RoHS: True
E2 E3 = Flomio Antenna: Antenna, No part; Part Number: Flomio Antenna; ComponentLink1Description: Local; ComponentLink2Description: Web; RoHS: True
FID7-FID9 = FID32: Fiducual, .032" Pad; Obsolete: False; Part Number: FID32; ComponentLink1Description: Local; ComponentLink1URL: \\brak\public\pdf\; ComponentLink2Description: Web; RoHS: False; Part Type: Misc\Fiducual
L3 = PM1008-R33K-RC: Inductor, 1008, 330nH, 0.33uH, 500mA, SRF 570MHz, SMT, 10%; Mfg: Bourns; Part Number: PM1008-R33K-RC; Mfg Part Number: PM1008-R33K-RC; ComponentLink1Description: Local; ComponentLink1URL: \\brak\public\pdf\Bournes PM1008 Series.pdf; ComponentLink2Description: Web; ComponentLink2URL: http://www.bourns.com/data/global/pdfs/pm1008_series.pdf; Supplier Part Number 1: M8472CT-ND; Supplier 1: Digi-Key; RoHS: True; Rating: 500mA; Tolerance: 10%
L4 = MLF1608A1R5K: Inductor, 0603, 1.5uH, 50mA, 10MHz, SMT, 0603, 10%; Mfg: TDK; Part Number: MLF1608A1R5K; Tolerance: 10%; Mfg Part Number: MLF1608A1R5K; ComponentLink1Description: Local; ComponentLink1URL: \\brak\public\pdf\TDK e511_mlf_02 Inductors.pdf; ComponentLink2Description: Web; ComponentLink2URL: http://www.yuden.co.jp/productdata/catalog/en/mlci04_e.pdf; Supplier Part Number 1: 445-1015-1-ND; Supplier 1: Digi-Key; RoHS: True
L5#2 = LQW2UASR15J00L: Inductor, 1008, 150nH, 580mA, SRF 850MHz, SMT, 5%; Mfg: Murata; Part Number: LQW2UASR15J00L; Rating: 580mA; Tolerance: 5%; Mfg Part Number: LQW2UASR15J00L; ComponentLink1Description: Local; ComponentLink1URL: \\newbrak\public\pdf\Murata LQW2UA Chip Inductors.pdf; ComponentLink2Description: Web; ComponentLink2URL: http://search.murata.co.jp/Ceramy/image/img/PDF/ENG/L0075S0080LQW2UA.pdf; Supplier Part Number 1: 490-5693-1-ND; Supplier 1: Digi-Key; Supplier 2: Mouser; Supplier Part Number 2: 81-LQW2UASR15J00L; Supplier 3: Digi-Key; Supplier Part Number 3: 535-10541-1-ND; RoHS: True
R2 = ERJ-3GEY0R00V: Resistor, 0603, Zero Ohm; Rating: 1/10W; Mfg: Panasonic; Part Number: ERJ-3GEY0R00V; Mfg Part Number: ERJ-3GEY0R00V; ComponentLink1Description: Local; ComponentLink1URL: \\brak\public\pdf\Panasonic AOA0000CE1 Chip Res.pdf; ComponentLink2Description: Web; Supplier Part Number 1: P0.0GCT-ND; Supplier 1: Digi-Key; RoHS: True; ComponentLink2URL: http://industrial.panasonic.com/www-data/pdf/AOA0000/AOA0000CE1.pdf
R4 = CRCW06031K20FKEA: Resistor, 0603, 1.20K Ohm 1%; Rating: 1/10W; Mfg: Vishay; Part Number: CRCW06031K20FKEA; Tolerance: 1%; Mfg Part Number: CRCW06031K20FKEA; ComponentLink1Description: Local; ComponentLink1URL: \\newbrak\public\pdf\Vishay CRCW Resistors.pdf; ComponentLink2Description: Web; ComponentLink2URL: http://www.vishay.com/docs/20035/dcrcwe3.pdf; Supplier Part Number 1: 541-1.20KHCT-ND; Supplier 1: Digi-Key; RoHS: True
R14 R15 = CRCW060310K0F: Resistor, 0603, 10.0K Ohm 1%; Mfg Part Number: CRCW060310K0FKEA; Rating: 1/10W; Mfg: Vishay; Part Number: CRCW060310K0F; Tolerance: 1%; ComponentLink1Description: Local; ComponentLink1URL: \\brak\public\pdf\Vishay CRCW Resistors.pdf; ComponentLink2Description: Web; ComponentLink2URL: http://www.vishay.com/doc?20035; Supplier Part Number 1: 541-10.0KHCT-ND; Supplier 1: Digi-Key; Supplier 2: Yageo; Supplier Part Number 2: RC0603FR-0710KL; Supplier 3: Digi-Key; Supplier Part Number 3: 311-10.0KHRCT-ND; RoHS: True
TP4-TP6 TP10-TP12 = TP18: as TP1 on sheet Flomio BLE-NFC - LED Array; ComponentLink1Description: Local; ComponentLink2Description: Web; RoHS: False
TP21 TP22 = TP28: Testpoint, 28mil Hole, No part, just via; Part Number: TP28; ComponentLink1Description: Local; ComponentLink2Description: Web; RoHS: False
U3 = TRF7970ARHBR: RFID/NFC Transceiver, 13.56MHz, 32QFN; Mfg: TI; Part Number: TRF7970ARHBR; Mfg Part Number: TRF7970ARHBR; ComponentLink1Description: Local; ComponentLink1URL: \\newbrak\public\pdf\TI TRF7970A RFID-NFC.pdf; ComponentLink2Description: Web; ComponentLink2URL: http://www.ti.com/lit/ds/symlink/trf7970a.pdf; Supplier Part Number 1: 296-29355-1-ND; Supplier 1: Digi-Key; RoHS: True
Y3#2 = ABM8G-13.560MHZ-18-D2Y-T: Crystal, SMT, 13.560MHz, 18pF; Tolerance: ±20ppm; Mfg: Abracon; Part Number: ABM8G-13.560MHZ-18-D2Y-T; Mfg Part Number: ABM8G-13.560MHZ-18-D2Y-T; ComponentLink1Description: Local; ComponentLink1URL: \\newbrak\public\pdf\Abracon ABM8G.pdf; ComponentLink2Description: Web; ComponentLink2URL: http://www.abracon.com/Resonators/ABM8G.pdf; Supplier Part Number 1: 535-10264-1-ND; Supplier 1: Digi-Key; RoHS: True

## Sheet Flomio BLE-NFC - Power.SchDoc: Flomio BLE-NFC::Power
size Tabloid; Author: Alex J. Tucker; CompanyName: Anidea Engineering, Inc.; DrawnBy: Alex J. Tucker; Engineer: Alex J. Tucker; Organization: Anidea Engineering, Inc.; Address1: 8020 Belvedere Rd.; Address2: Ste #1; Address3: West Palm Beach, FL; Address4: 33411    USA; DocumentNumber: 5; Revision: 3; SheetNumber: 5; SheetTotal: 5
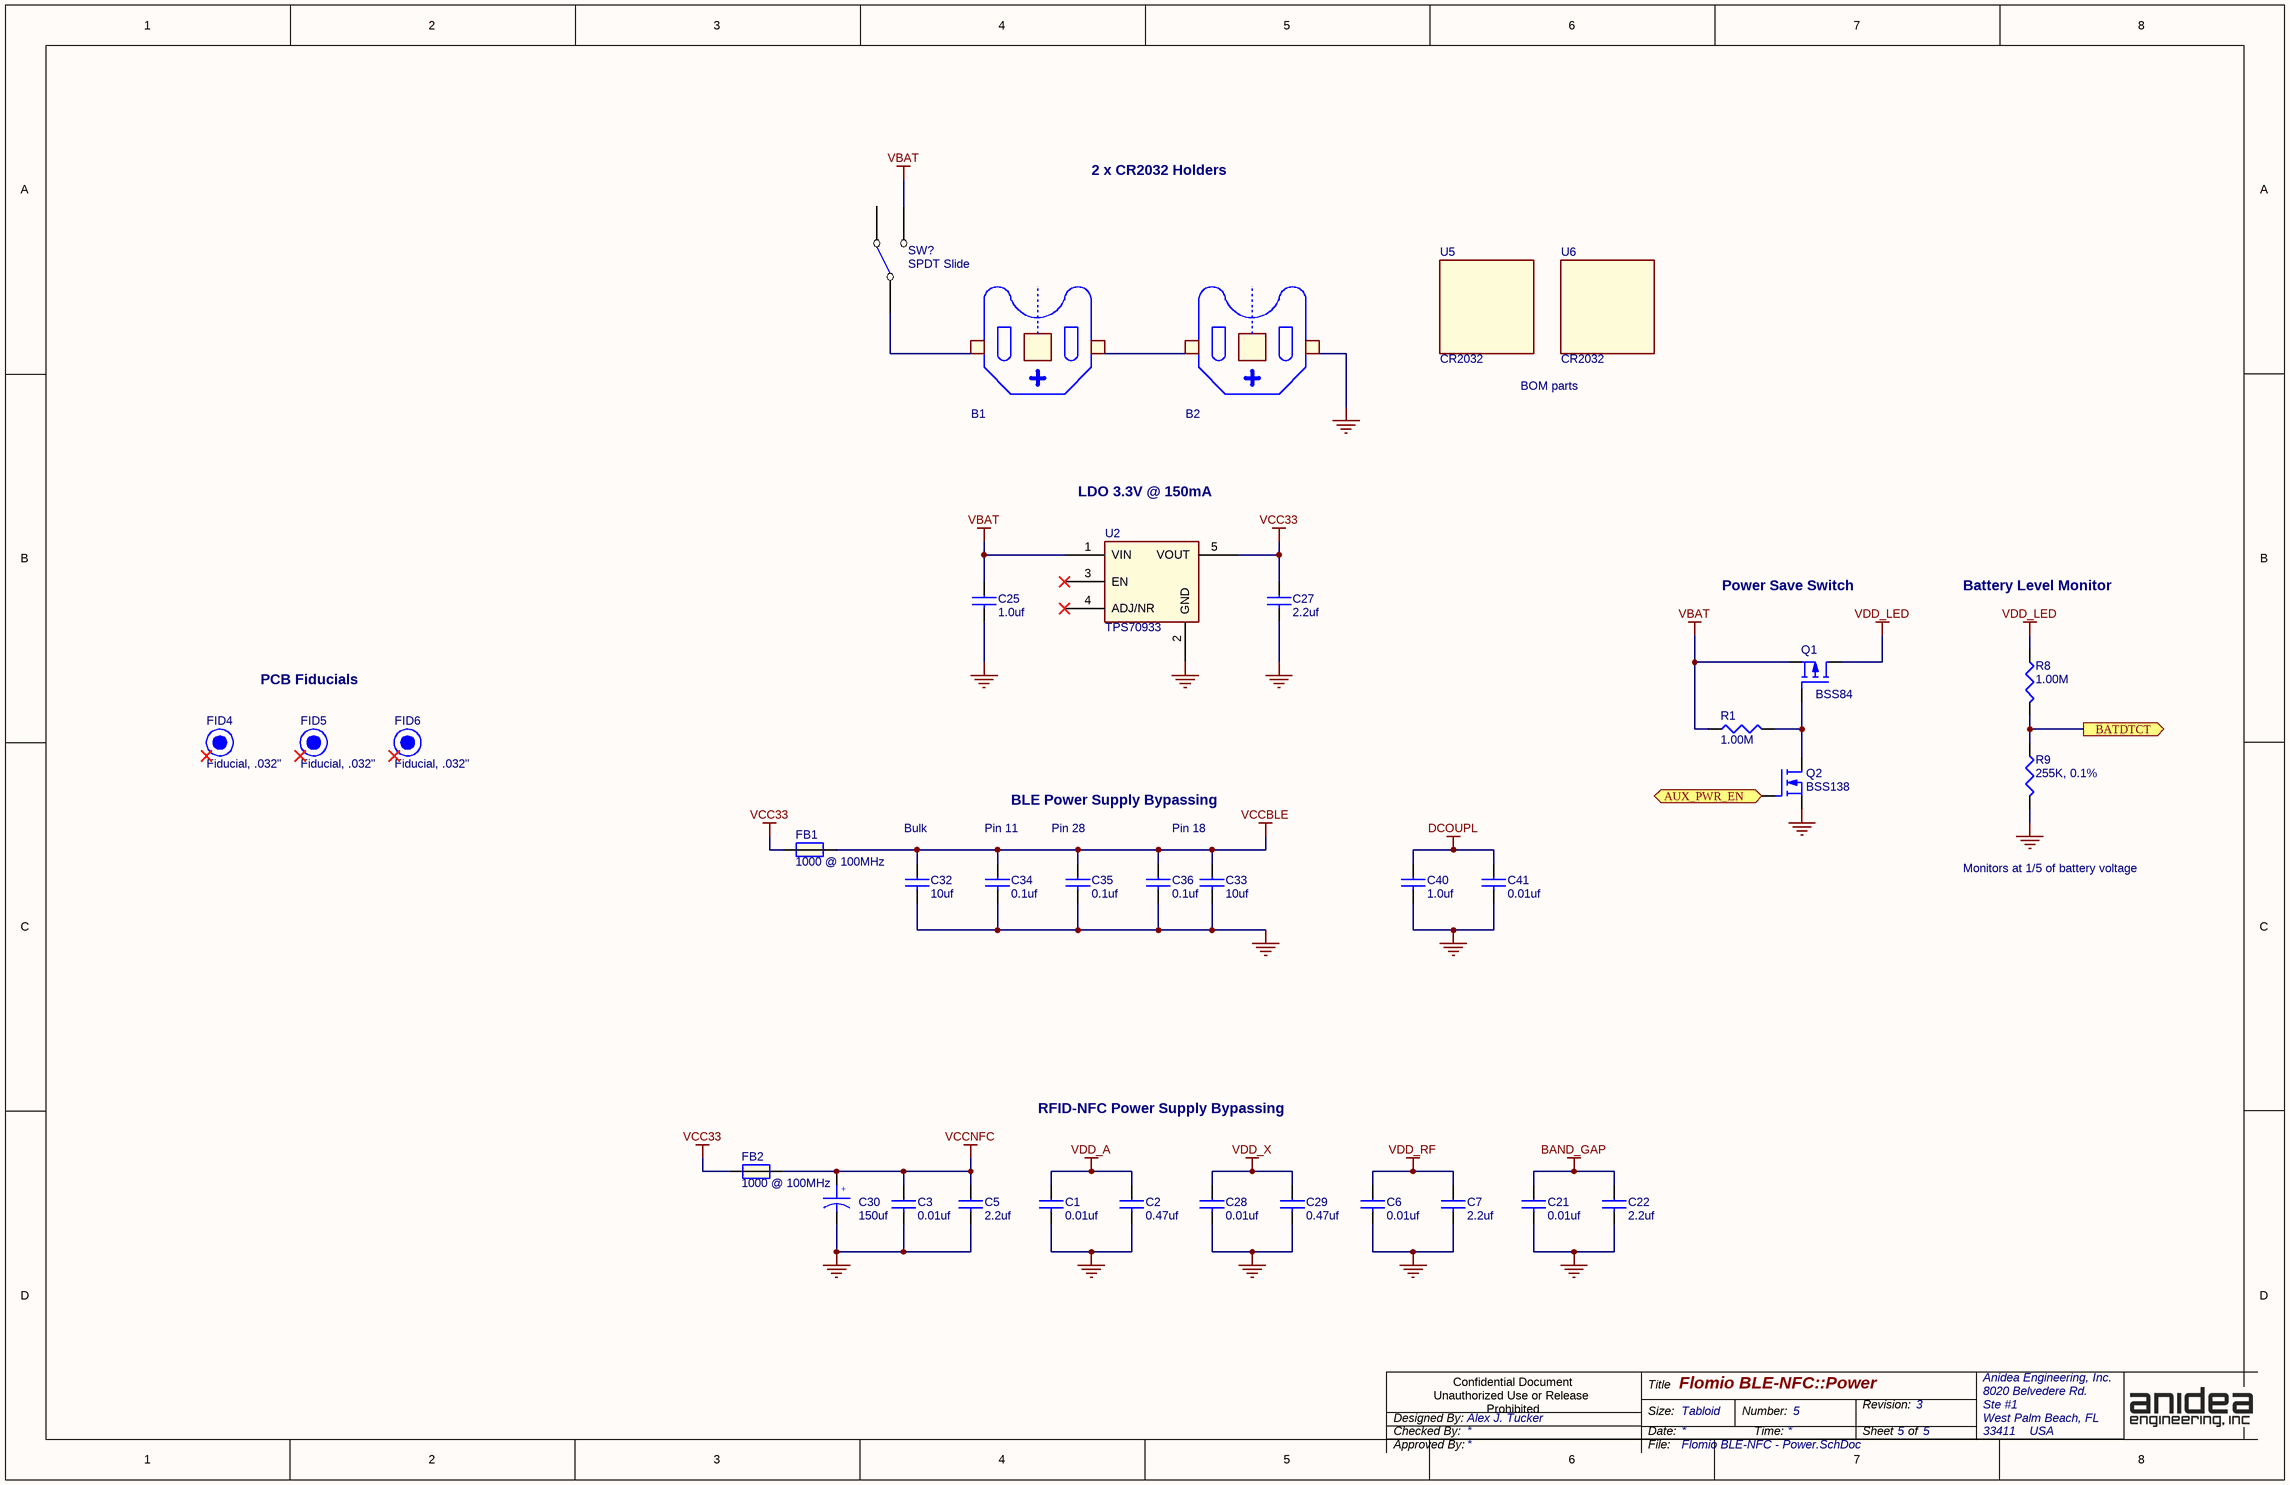
[diagram p4: Flomio BLE-NFC - Power.SchDoc]

### Parts
(Parts that share a designator on the sheet are numbered #1, #2 ... from top to bottom, then left to right.)
B1  CLIP  [BATT/BK-912]  (value not drawn)
B2  CLIP  [BATT/BK-912]  (value not drawn)
C1  0.01uf  [SM/C_0603]
C2  0.47uf  [SM/C_0603]
C3  0.01uf  [SM/C_0603]
C5  2.2uf  [SM/C_0603]
C6  0.01uf  [SM/C_0603]
C7  2.2uf  [SM/C_0603]
C21  0.01uf  [SM/C_0603]
C22  2.2uf  [SM/C_0603]
C25  1.0uf  [SM/C_0603]
C27  2.2uf  [SM/C_0603]
C28  0.01uf  [SM/C_0603]
C29#2  0.47uf  [SM/C_0603]
C30  150uf  [SM/C_2917(7343m)]
C32  10uf  [SM/C_0603]
C33#2  10uf  [SM/C_0603]
C34#2  0.1uf  [SM/C_0603]
C35  0.1uf  [SM/C_0603]
C36  0.1uf  [SM/C_0603]
C40  1.0uf  [SM/C_0603]
C41  0.01uf  [SM/C_0603]
FB1  1000 @ 100MHz  [SM/I_0603]
FB2  1000 @ 100MHz  [SM/I_0603]
FID4  Fiducial, .032"  [FID32]  (no BOM)
FID5  Fiducial, .032"  [FID32]  (no BOM)
FID6  Fiducial, .032"  [FID32]  (no BOM)
Q1  BSS84  [SOT23]
Q2  BSS138  [SOT23]
R1  1.00M  [SM/R_0603]
R8  1.00M  [SM/R_0603]
R9  255K, 0.1%  [SM/R_0603]
SW?  SPDT Slide  [SWITCH/CK/JS/SPDT]
U2  TPS70933  [SOT23-5]
U5  CR2032  (mechanical)
U6  CR2032  (mechanical)

### Ports
AUX_PWR_EN (in), BATDTCT (out)

### Nets
BAND_GAP: C21.1 C22.1
DCOUPL: C40.1 C41.1
GND: B2.3(P2) C1.2 C2.2 C3.2 C5.2 C6.2 C7.2 C21.2 C22.2 C25.2 C27.2 C28.2 C29#2.2 C30.2 C32.2 C33#2.2 C34#2.2 C35.2 C36.2 C40.2 C41.2 Q2.2(S) R9.2 U2.2(GND)
VBAT: C25.1 Q1.2(S) R1.1 SW?.3(NO) U2.1(VIN)
VCC33: C27.1 FB1.1 FB2.1 U2.5(VOUT)
VCCBLE: C32.1 C33#2.1 C34#2.1 C35.1 C36.1 FB1.2
VCCNFC: C3.1 C5.1 C30.1 FB2.2
VDD_A: C1.1 C2.1
VDD_LED: Q1.3(D) R8.1
VDD_RF: C6.1 C7.1
VDD_X: C28.1 C29#2.1
BATDTCT: R8.2 R9.1 ; port BATDTCT
NetB1_2: B1.2(P1) SW?.1(COMMON)
NetB1_3: B1.3(P2) B2.2(P1)
NetQ1_1: Q1.1(G) Q2.3(D) R1.2
NetQ2_1: Q2.1(G) ; port AUX_PWR_EN

Not connected (* = marked no-connect by the designer): B1 1(M); B2 1(M); FID4 1*; FID5 1*; FID6 1*; SW? 2(NC); U2 3(EN)* 4(ADJ/NR)*

### Notes on the sheet
- 2 x CR2032 Holders
- BOM parts
- LDO 3.3V @ 150mA
- Power Save Switch
- Battery Level Monitor
- PCB Fiducials
- (near C32) Bulk
- (near C34#2) Pin 11
- BLE Power Supply Bypassing
- (near C35) Pin 28
- Pin 18
- Monitors at 1/5 of battery voltage
- RFID-NFC Power Supply Bypassing
- Confidential Document
  Unauthorized Use or Release
  Prohibited
- Checked By:
- Designed By:
- Title
- Size:
- Date:
- Tabloid
- Number:
- Time:
- Revision:
- Sheet
- of
- Approved By:
- File:
- (in symbol RVB0J151MNG) +

### Library data of the parts
B1 B2 = BK-912: Battery Holder, Retainer, C2032, Coin Cell, Surface Mount; Part Number: BK-912; Mfg: MPD; Mfg Part Number: BK-912; ComponentLink1Description: Local; ComponentLink1URL: \\newbrak\public\pdf\MPD BK-912 CR2032 Retainer.pdf; ComponentLink2Description: Web; ComponentLink2URL: http://www.memoryprotectiondevices.com/datasheets/BK-912-datasheet.pdf; Supplier Part Number 1: BK-912-ND; Supplier 1: Digi-Key; RoHS: True
C1 C3 C6 C21 C28 C41 = C0603C103M3RACTU: Cap, 0603, 0.01uf, 10000pf, 25V, 20%, X7R; Rating: -55°C ~ 125°C; Mfg: Vishay; Part Number: C0603C103M3RACTU; Tolerance: 20%; Voltage: 25V; Mfg Part Number: C0603C103M3RACTU; ComponentLink1Description: Local; ComponentLink1URL: \\brak\public\pdf\Kemet Ceramic X7R.pdf; ComponentLink2Description: Web; ComponentLink2URL: http://www.kemet.com/kemet/web/homepage/kechome.nsf/vapubfiles/KEM_C1002_X7R_SMD.pdf/$file/KEM_C1002_X7R_SMD.pdf; Supplier Part Number 1: 399-8989-1-ND; Supplier 1: Digi-Key; Supplier 2: AVX; Supplier Part Number 2: 06033C103MAT2A; Supplier 3: Digi-Key; Supplier Part Number 3: 478-7903-1-ND; RoHS: True
C2 C29#2 = GRM188R61A474KA61: Cap, 0603, 0.47uf, 10V, 10%, X5R; Mfg Part Number: GRM188R61A474KA61D; Mfg: Murata; Part Number: GRM188R61A474KA61; Tolerance: 10%; Voltage: 10V; ComponentLink1Description: Local; ComponentLink1URL: \\brak\public\pdf\Murata Cap PN.pdf; ComponentLink2Description: Web; Supplier Part Number 1: 490-1539-1-ND; Supplier 1: Digi-Key; RoHS: True
C5 C7 C22 C27 = GRM188R61A225ME34D: Cap, 0603, 2.2uf , 10V, 20%, X5R; Mfg: Murata; Part Number: GRM188R61A225ME34D; Tolerance: 20%; Voltage: 10V; Mfg Part Number: GRM188R61A225ME34D; ComponentLink1Description: Local; ComponentLink1URL: \\brak\public\pdf\Murata Cap PN.pdf; ComponentLink2Description: Web; Supplier Part Number 1: 490-1546-1-ND; Supplier 1: Digi-Key; RoHS: True
C25 C40 = GRM188R71A105KA61: Cap, 0603, 1.0uf, 10V, 10%, X7R; Mfg Part Number: GRM188R71A105KA61D; Mfg: Murata; Part Number: GRM188R71A105KA61; Tolerance: 10%; Voltage: 10V; ComponentLink1Description: Local; ComponentLink1URL: \\brak\public\pdf\Murata Cap PN.pdf; ComponentLink2Description: Web; Supplier Part Number 1: 490-3899-1-ND; Supplier 1: Digi-Key; RoHS: True
C30 = RVB0J151MNG: Cap, SMT 2917, 150uf, 6.3V, 20%, Al Ele; Mfg: Nichicon; Part Number: RVB0J151MNG; Tolerance: 20%; Voltage: 6.3V; Mfg Part Number: RVB0J151MNG; ComponentLink1Description: Local; ComponentLink1URL: \\brak\Public\pdf\Nichicon Type va_e Al El flat.pdf; ComponentLink2Description: Web; ComponentLink2URL: http://nichicon-us.com/english/products/pdfs/va_e.pdf; Supplier Part Number 1: 493-7063-1-ND; Supplier 1: Digi-Key; Supplier 2: Panasonic; Supplier Part Number 2: EEF-CX0J151XR; Supplier 3: Digi-Key; Supplier Part Number 3: PCE4940CT-ND; RoHS: True
C32 C33#2 = GRM1886ME47: as C38 on sheet Flomio BLE-NFC - SoC; Part Number: GRM1886ME47; Tolerance: 20%; Voltage: 6.3V; ComponentLink1Description: Local; ComponentLink1URL: \\newbrak\public\pdf\Murata Cap PN.pdf; ComponentLink2Description: Web; Supplier Part Number 1: 490-3896-1-ND; Supplier 1: Digi-Key; RoHS: True
C34#2 C35 C36 = GRM188R71C104KA01: as C11 on sheet Flomio BLE-NFC - SoC; Part Number: GRM188R71C104KA01; Rating: X7R; Tolerance: 10%; Voltage: 16V; ComponentLink1Description: Local; ComponentLink1URL: \\brak\public\pdf\Murata Cap PN.pdf; ComponentLink2Description: Web; Supplier Part Number 1: 490-1532-1-ND; Supplier 1: Digi-Key; RoHS: True
FB1 FB2 = BLM18HE102SN1: EMI Bead, 0603, 1000 OHM @ 100MHz, Ferrite, .35 DCR; Mfg Part Number: BLM18HE102SN1D; Rating: 600mA; Mfg: Murata; Part Number: BLM18HE102SN1; ComponentLink1Description: Local; ComponentLink1URL: \\brak\public\pdf\Murata BLM18H Ferrite Bead.pdf; ComponentLink2Description: Web; ComponentLink2URL: http://search.murata.co.jp/Ceramy/image/img/PDF/ENG/L0110S0101BLM18H.pdf; Supplier Part Number 1: 490-5215-1-ND; Supplier 1: Digi-Key; RoHS: True
FID4-FID6 = FID32: Fiducual, .032" Pad; Obsolete: False; Part Number: FID32; ComponentLink1Description: Local; ComponentLink1URL: \\brak\public\pdf\; ComponentLink2Description: Web; RoHS: False; Part Type: Misc\Fiducual
Q1 = BSS84: Transistor, P-Mosfet, 130ma, 50V; Mfg Part Number: BSS84LT1; Mfg: On Semi; Part Number: BSS84; Rating: 130MA; ComponentLink1Description: Local; ComponentLink1URL: \\newbrak\public\pdf\OnSemi BSS84LT1.pdf; ComponentLink2Description: Web; Supplier Part Number 1: BSS84CT-ND; Supplier 1: Digi-Key; RoHS: True
Q2 = BSS138: Transistor, N-Mosfet, 200ma, 50V; Mfg Part Number: BSS138LT1; Mfg: On Semi; Part Number: BSS138; Rating: 200MA; Voltage: 50V; ComponentLink1Description: Local; ComponentLink1URL: \\newbrak\public\pdf\OnSemi BSS138.pdf; ComponentLink2Description: Web; Supplier Part Number 1: BSS138CT-ND; Supplier 1: Digi-Key; RoHS: True
R1 R8 = CRCW06031M00F: Resistor, 0603, 1.00M Ohm 1%; Mfg Part Number: CRCW06031M00FKEA; Rating: 1/10W; Mfg: Vishay; Part Number: CRCW06031M00F; Tolerance: 1%; ComponentLink1Description: Local; ComponentLink1URL: \\brak\public\pdf\Vishay CRCW Resistors.pdf; ComponentLink2Description: Web; ComponentLink2URL: http://www.vishay.com/doc?20035; Supplier Part Number 1: 541-1.00MHCT-ND; Supplier 1: Digi-Key; Supplier 2: Yageo; Supplier Part Number 2: RC0603FR-071ML; Supplier 3: Digi-Key; Supplier Part Number 3: 311-1.00MHRCT-ND; RoHS: True
R9 = ERA-3AEB2553V: Resistor, 0603, 255K Ohm, 0.1%; Rating: 1/10W; Mfg: Panasonic; Part Number: ERA-3AEB2553V; Tolerance: 0.1%; Mfg Part Number: ERA-3AEB2553V; ComponentLink1Description: Local; ComponentLink1URL: \\brak\public\pdf\Panasonic ERA High Reliability Chip Res.pdf; ComponentLink2Description: Web; ComponentLink2URL: http://industrial.panasonic.com/www-data/pdf/AOA0000/AOA0000CE26.pdf; Supplier Part Number 1: P255KDBCT-ND; Supplier 1: Digi-Key; RoHS: True
SW? = JS102011SAQN: Switch, Slide, SPDT, 2 Position, RA, Miniature; Rating: .3A @ 6V; Mfg: C & K; Part Number: JS102011SAQN; Mfg Part Number: JS102011SAQN; ComponentLink1Description: Local; ComponentLink1URL: \\newbrak\public\pdf\C&K JS Series Sub Miniature Switch.pdf; ComponentLink2Description: Web; ComponentLink2URL: http://www.ck-components.com/index.php?module=media&action=Display&cmpref=14398&lang=en&width=&height=&format=&alt=; Supplier Part Number 1: 401-1999-1-ND; Supplier 1: Digi-Key; RoHS: True
U2 = TPS70933DBVR: Regulator, 3.3V, LDO, 150mA, Linear Regulator, 1uA Iq, Vin 2.7-30 V; Mfg: TI; Part Number: TPS70933DBVR; Rating: 150mA; Mfg Part Number: TPS70933DBVR; ComponentLink1Description: Local; ComponentLink1URL: \\brak\public\pdf\TI TPS709xx LDO 1uA Iq.pdf; ComponentLink2Description: Web; ComponentLink2URL: http://www.ti.com/lit/ds/symlink/tps70933.pdf; Supplier Part Number 1: 296-35483-1-ND; Supplier 1: Digi-Key; RoHS: True
U5 U6 = CR2032: Battery, 2032, 225mAh; Mfg: Panasonic; Part Number: CR2032; Mfg Part Number: CR2032; ComponentLink1Description: Local; ComponentLink1URL: \\newbrak\public\pdf\Panasonic CR Series Datasheets Merged.pdf; ComponentLink2Description: Web; ComponentLink2URL: http://na.industrial.panasonic.com/sites/default/pidsa/files/crseries_datasheets_merged.pdf; Supplier Part Number 1: P189-ND; Supplier 1: Digi-Key; RoHS: True

## Nets that join several sheets
BAND_GAP: Flomio BLE-NFC - RFID (U3.11), Flomio BLE-NFC - Power (C21.1 C22.1)
DCOUPL: Flomio BLE-NFC - SoC (U4.12), Flomio BLE-NFC - Power (C40.1 C41.1)
GND: Flomio BLE-NFC - LED Array (9 pins), Flomio BLE-NFC - SoC (19 pins), Flomio BLE-NFC - RFID (22 pins), Flomio BLE-NFC - Power (24 pins)
VBAT: Flomio BLE-NFC - LED Array (LED1.2 LED2.2 LED3.2 LED4.2), Flomio BLE-NFC - Power (5 pins)
VCCBLE: Flomio BLE-NFC - SoC (5 pins), Flomio BLE-NFC - Power (6 pins)
VCCNFC: Flomio BLE-NFC - RFID (U3.2 U3.16 U3.18 U3.19), Flomio BLE-NFC - Power (C3.1 C5.1 C30.1 FB2.2)
VDD_A: Flomio BLE-NFC - RFID (U3.1), Flomio BLE-NFC - Power (C1.1 C2.1)
VDD_LED: Flomio BLE-NFC - LED Array (L1.1), Flomio BLE-NFC - Power (Q1.3 R8.1)
VDD_RF: Flomio BLE-NFC - RFID (U3.3 U3.4), Flomio BLE-NFC - Power (C6.1 C7.1)
VDD_X: Flomio BLE-NFC - RFID (U3.32), Flomio BLE-NFC - Power (C28.1 C29#2.1)
ANT_MON: Flomio BLE-NFC - SoC (D1.1), Flomio BLE-NFC - RFID (7 pins)
ASK: Flomio BLE-NFC - SoC (TP27.1 U4.8), Flomio BLE-NFC - RFID (U3.12)
BATDTCT: Flomio BLE-NFC - SoC (R10.1 TP17.1 U4.16), Flomio BLE-NFC - Power (R8.2 R9.1)
CI1: Flomio BLE-NFC - LED Array (TP2.1 U1.11), Flomio BLE-NFC - SoC (TP26.1 U4.9)
CLK: Flomio BLE-NFC - SoC (TP24.1 U4.22), Flomio BLE-NFC - RFID (U3.26)
DATA_IN: Flomio BLE-NFC - LED Array (TP9.1 U1.12), Flomio BLE-NFC - SoC (TP25.1 U4.10)
EN: Flomio BLE-NFC - SoC (TP29.1 U4.6), Flomio BLE-NFC - RFID (U3.28)
GPIO1: Flomio BLE-NFC - SoC (TP16.1 U4.26), Flomio BLE-NFC - RFID (U3.20)
GPIO2: Flomio BLE-NFC - SoC (TP18.1 U4.25), Flomio BLE-NFC - RFID (U3.22)
IRQ: Flomio BLE-NFC - SoC (R11.1 TP20.1 U4.15), Flomio BLE-NFC - RFID (U3.13)
MISO: Flomio BLE-NFC - SoC (TP23.1 U4.23), Flomio BLE-NFC - RFID (U3.23)
MOD: Flomio BLE-NFC - SoC (TP28.1 U4.7), Flomio BLE-NFC - RFID (U3.14)
MOSI: Flomio BLE-NFC - SoC (TP19.1 U4.24), Flomio BLE-NFC - RFID (U3.24)
NetQ2_1: Flomio BLE-NFC - SoC (TP13.1 U4.20), Flomio BLE-NFC - Power (Q2.1)
SLAVE_SELECT: Flomio BLE-NFC - SoC (U4.21), Flomio BLE-NFC - RFID (U3.21)

## Assembly variants
Build: not fitted B1 B2 B3 B4 C34 C? E2 E3 L7 R4 R7 R21 R22